# EAGLE design 858D_v2 (EAGLE 6.4)
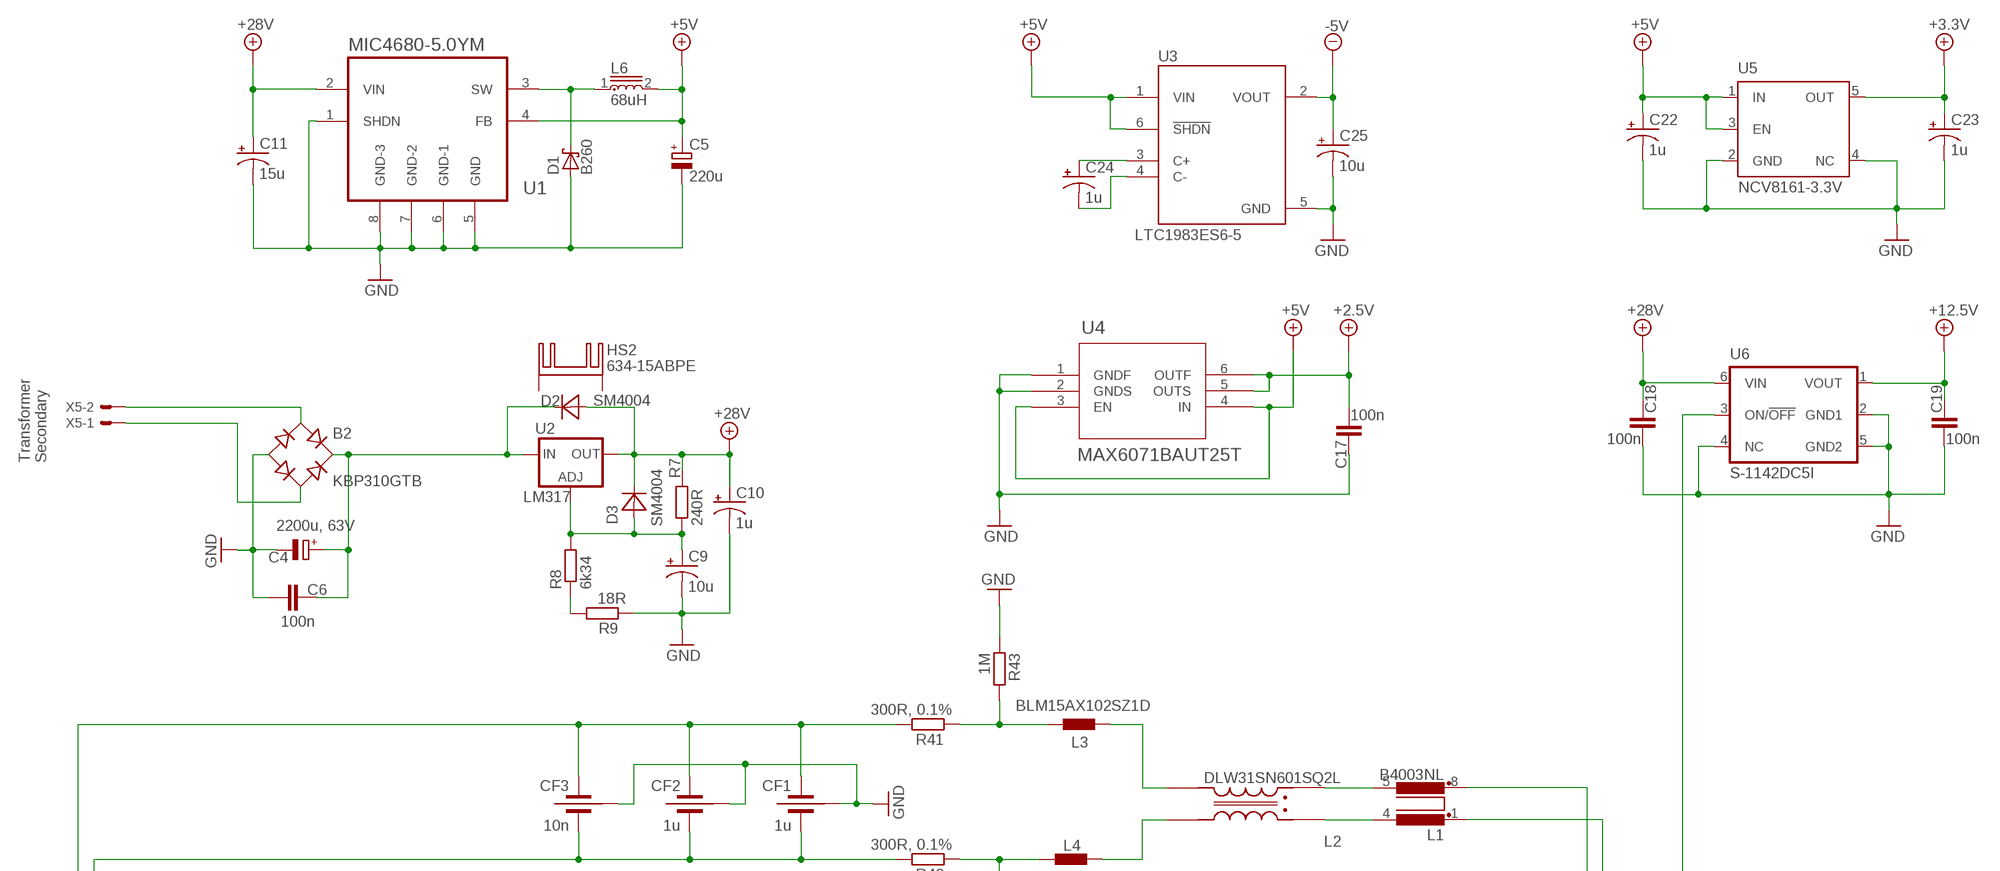
[diagram p0: schematic, sheet 1, part 1 of 2]
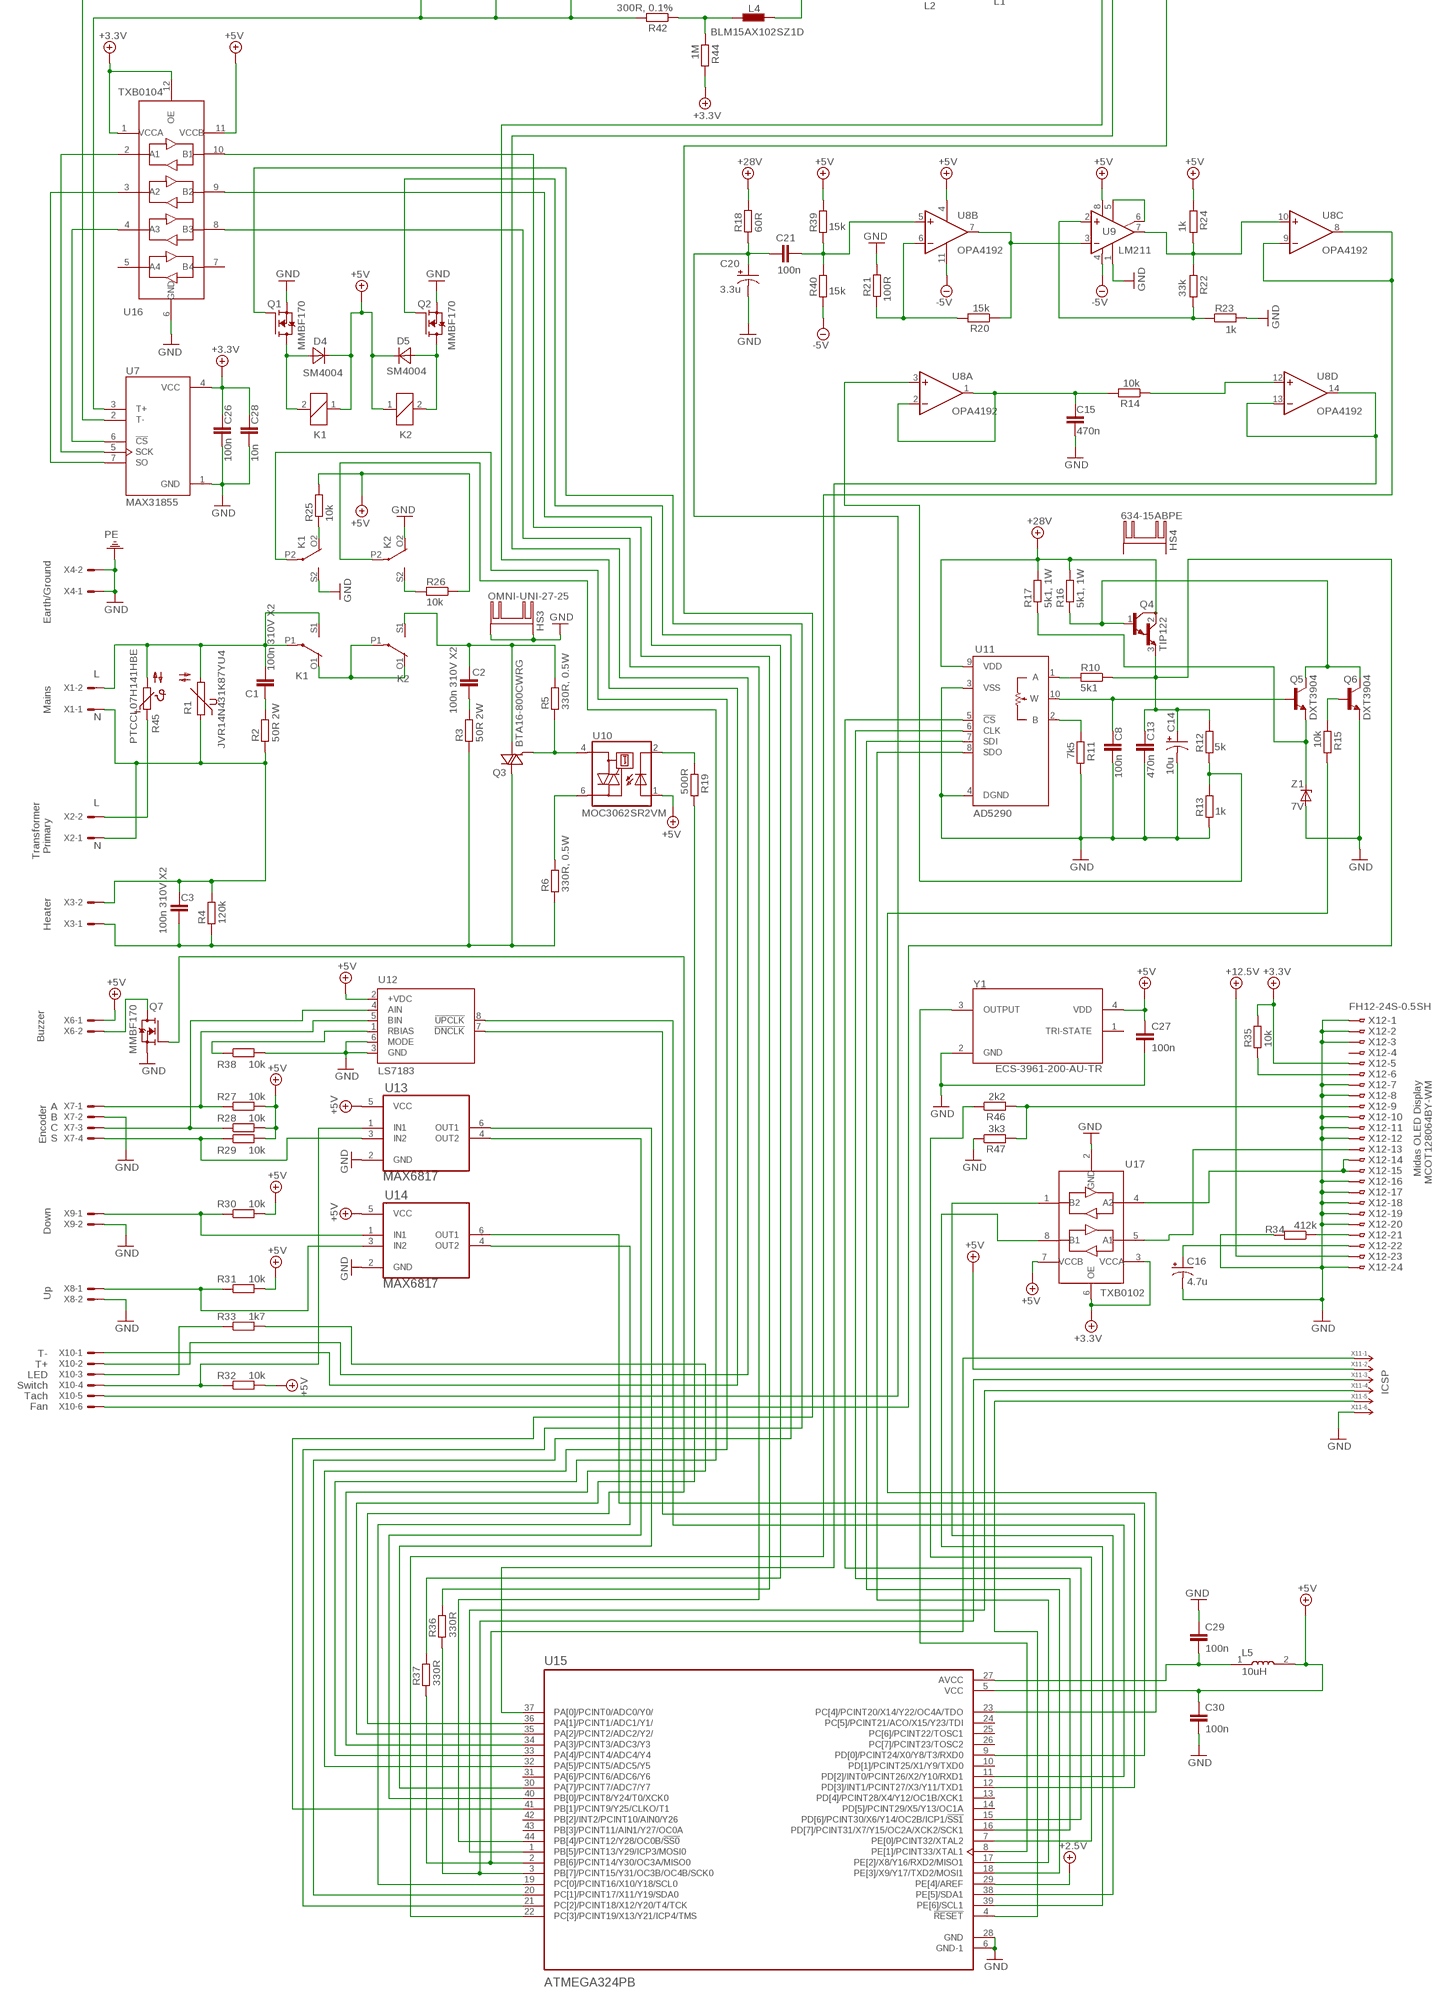
[diagram p1: schematic, sheet 1, part 2 of 2]

## Parts
B2  KBP310GTB  RECTIFIER-2KBP  [2KBP]
C1  100n 310V X2  C10/6  [C10B6]
C2  100n 310V X2  C10/6  [C10B6]
C3  100n 310V X2  C10/6  [C10B6]
C4  2200u, 63V  CPOL-EUE7.5-18  [E7,5-18]
C5  220u  CPOL-EUUD-8X10  [UD-8X10_NICHICON]
C6  100n  C-EUC1206  [C1206]
C8  100n  C-EUC1206  [C1206]
C9  10u  CPOL-USCT7343  [CT7343]
C10  1u  CPOL-USB/3528-21W  [B/3528-21W]
C11  15u  CPOL-USCT7343  [CT7343]
C13  470n  C-EUC1206  [C1206]
C14  10u  CPOL-USCT7343  [CT7343]
C15  470n  C-EUC1206  [C1206]
C16  4.7u  CPOL-USB/3528-21W  [B/3528-21W]
C17  100n  C-EUC1206  [C1206]
C18  100n  C-EUC1206  [C1206]
C19  100n  C-EUC1206  [C1206]
C20  3.3u  CPOL-USB/3528-21W  [B/3528-21W]
C21  100n  C-EUC1206  [C1206]
C22  1u  CPOL-USB/3528-21W  [B/3528-21W]
C23  1u  CPOL-USB/3528-21W  [B/3528-21W]
C24  1u  CPOL-USB/3528-21W  [B/3528-21W]
C25  10u  CPOL-USCT7343  [CT7343]
C26  100n  C-EUC1206  [C1206]
C27  100n  C-EUC1206  [C1206]
C28  10n  C-EUC0603  [C0603]
C29  100n  C-EUC1206  [C1206]
C30  100n  C-EUC1206  [C1206]
CF1  1u  X2Y1206  [C1206-X2Y]
CF2  1u  X2Y1206  [C1206-X2Y]
CF3  10n  X2Y06030603  [C0603-X2Y]
D1  B260  SCHOTTKY-DIODESMA  [SMA-DO214AC_2]
D2  SM4004  [SOD123FL]
D3  SM4004  [SOD123FL]
D4  SM4004  [SOD123FL]
D5  SM4004  [SOD123FL]
HS2  634-15ABPE  [634-15ABPE]
HS3  OMNI-UNI-27-25  [OMNI-UNI-27-25]
HS4  634-15ABPE  [634-15ABPE]
K1  4052  [F4052]
K2  4052  [F4052]
L1  B4003NL  [SMD-VERTICAL]
L2  DLW31SN601SQ2L  DLW31SN900SQ2L  [FIL_DLW31SN900SQ2L]
L3  BLM15AX102SZ1D  BLM15HB121SN1  [0402]
L4  BLM15AX102SZ1D  BLM15HB121SN1  [0402]
L5  10uH  KLZ1608MHR100WTD25  [INDC1608X95N]
L6  68uH  SRN8040A  [SRN8040]
Q1  MMBF170  MMBF170LT1G  [SOT23]
Q2  MMBF170  MMBF170LT1G  [SOT23]
Q3  BTA16-800CWRG  BT138-V  [TO220BV]
Q4  TIP122  TIP122-V  [TO220V]
Q5  DXT3904  [SOT89-BCE]
Q6  DXT3904  [SOT89-BCE]
Q7  MMBF170  MMBF170LT1G  [SOT23]
R1  JVR14N431K87YU4  S14K11  [S14K11]
R2  50R 2W  R-EU_0613/5V  [P0613V]
R3  50R 2W  R-EU_0613/5V  [P0613V]
R4  120k  R-EU_0207/10  [0207/10]
R5  330R, 0.5W  R-EU_R0805  [R0805]
R6  330R, 0.5W  R-EU_R0805  [R0805]
R7  240R  R-EU_R0603  [R0603]
R8  6k34  R-EU_R0603  [R0603]
R9  18R  R-EU_R0603  [R0603]
R10  5k1  R-EU_R0402  [R0402]
R11  7k5  R-EU_R0603  [R0603]
R12  5k  R-EU_R0402  [R0402]
R13  1k  R-EU_R0402  [R0402]
R14  10k  R-EU_R0402  [R0402]
R15  10k  R-EU_R0402  [R0402]
R16  5k1, 1W  R-EU_0411/3V  [0411V]
R17  5k1, 1W  R-EU_0411/3V  [0411V]
R18  60R  R-EU_R0805  [R0805]
R19  500R  R-EU_R0402  [R0402]
R20  15k  R-EU_R0402  [R0402]
R21  100R  R-EU_R0402  [R0402]
R22  33k  R-EU_R0402  [R0402]
R23  1k  R-EU_R0402  [R0402]
R24  1k  R-EU_R0402  [R0402]
R25  10k  R-EU_R0402  [R0402]
R26  10k  R-EU_R0402  [R0402]
R27  10k  R-EU_R0402  [R0402]
R28  10k  R-EU_R0402  [R0402]
R29  10k  R-EU_R0402  [R0402]
R30  10k  R-EU_R0402  [R0402]
R31  10k  R-EU_R0402  [R0402]
R32  10k  R-EU_R0402  [R0402]
R33  1k7  R-EU_R0603  [R0603]
R34  412k  R-EU_R0603  [R0603]
R35  10k  R-EU_R0402  [R0402]
R36  330R  R-EU_R0402  [R0402]
R37  330R  R-EU_R0402  [R0402]
R38  10k  R-EU_R0402  [R0402]
R39  15k  R-EU_R0402  [R0402]
R40  15k  R-EU_R0402  [R0402]
R41  300R, 0.1%  R-EU_R0603  [R0603]
R42  300R, 0.1%  R-EU_R0603  [R0603]
R43  1M  R-EU_R0402  [R0402]
R44  1M  R-EU_R0402  [R0402]
R45  PTCCL07H141HBE  B57164  [B57164]
R46  2k2  R-EU_R0402  [R0402]
R47  3k3  R-EU_R0402  [R0402]
U1  MIC4680-5.0YM  [SOIC127P600X175-8N]
U2  LM317  LM317TS  [317TS]
U3  LTC1983ES6-5  LTC1983ES6-5#TRPBF  [SOT95P280X100-6N]
U4  MAX6071BAUT25T  [21-0058I]
U5  NCV8161-3.3V  NCV8161ASN330T1G  [SOT23-DBV]
U6  S-1142DC5I  S-1142CC5I-E6T1U  [HSOP-6]
U7  MAX31855  [SOIC127P600X175-8N]
U8  OPA4192  OP11D  [SO14]
U9  LM211  LM311D  [SO08]
U10  MOC3062SR2VM  MOC3041S  [DIL6-SMD]
U11  AD5290  [MSOP10]
U12  LS7183  LS7183-SOIC  [SOIC08]
U13  MAX6817  MAX6817EUT+T  [SOT95P280X145-6N]
U14  MAX6817  MAX6817EUT+T  [SOT95P280X145-6N]
U15  ATMEGA324PB  ATMEGA324PB-ANR  [QFP80P1200X1200X120-44N]
U16  TXB0104  TXB0104UQFN  [QFN40P170X200X50-12N]
U17  TXB0102  TXB01028-VFSOP  [8-VFSOP]
X1  KK-156-2  [KK-156-2]
X2  KK-156-2  [KK-156-2]
X3  KK-156-2  [KK-156-2]
X4  KK-156-2  [KK-156-2]
X5  KK-156-2  [KK-156-2]
X6  22-23-2021  [22-23-2021]
X7  22-23-2041  [22-23-2041]
X8  22-23-2021  [22-23-2021]
X9  22-23-2021  [22-23-2021]
X10  22-23-2061  [22-23-2061]
X11  87758-06_S  [87758-06]
X12  FH12-24S-0.5SH  [FH12-24S-0.5SH]
Y1  ECS-3961-200-AU-TR  [OSC_ECS-3961-200-AU-TR]
Z1  7V  ZENER-DIODEDO-219AC  [MICROSMF]

## Nets
28AC1: B2.AC2 X5.1
28AC2: B2.AC1 X5.2
28DC: B2.+ C4.+ C6.2 D2.C U2.3(IN)
+2.5V: C17.2 U4.5(OUTS) U4.6(OUTF) U15.29(PE[4]/AREF)
+3.3V: C23.+ C26.1 C28.1 R35.1 R44.2 U5.5(OUT) U7.4(VCC) U16.1(VCCA) U16.12(OE) U17.3(VCCA) U17.6(OE) X12.5
+5V: C5.+ C22.+ C27.1 C30.1 D4.C D5.C K1.1 K2.1 L5.2 L6.2 R24.1 R25.2 R26.1 R27.2 R28.2 R29.2 R30.2 R31.2 R32.2 R39.1 U1.4(FB) U3.1(VIN) U3.6(!SHDN) U4.3(EN) U4.4(IN) U5.1(IN) U5.3(EN) U8.4(P:V+) U9.8(V+) U10.1(A) U12.2(+VDC) U13.5(VCC) U14.5(VCC) U15.5(VCC) U16.11(VCCB) U17.7(VCCB) X6.1 X11.2 Y1.4(VDD)
+12.5V: C19.1 U6.1(VOUT) X12.23
+28V: C10.+ C11.+ C18.1 D2.A D3.C Q4.2(C) R7.2 R16.2 R17.2 R18.2 U1.2(VIN) U2.2(OUT) U6.6(VIN) U11.9(VDD)
-5V: C25.+ R40.2 U3.2(VOUT) U8.11(P:V-) U9.4(V-)
FAN: C13.1 C14.+ Q4.3(E) R10.1 R12.1 X10.6
GND: B2.- C4.- C5.- C6.1 C8.2 C9.- C10.- C11.- C13.2 C14.- C15.2 C16.- C17.1 C18.2 C19.2 C20.- C22.- C23.- C25.- C26.2 C27.2 C28.2 C29.1 C30.2 CF1.3 CF2.3 CF3.3 D1.A HS3.A2,2(K) HS3.B2,2(K) K1.S2(3:S) K2.O2(3:O) Q1.2(S) Q2.2(S) Q6.E Q7.2(S) R9.1 R11.2 R13.2 R21.2 R23.2 R34.2 R38.2 R43.1 R47.1 U1.1(SHDN) U1.5(GND) U1.6(GND-1) U1.7(GND-2) U1.8(GND-3) U3.5(GND) U4.1(GNDF) U4.2(GNDS) U5.2(GND) U5.4(NC) U6.2(GND1) U6.4(NC) U6.5(GND2) U7.1(GND) U9.1(GND) U11.3(VSS) U11.4(DGND) U12.3(GND) U12.6(MODE) U13.2(GND) U14.2(GND) U15.6(GND-1) U15.28(GND) U16.6(GND) U17.2(GND) X4.1 X4.2 X7.2 X8.2 X9.2 X11.6 X12.1 X12.2 X12.3 X12.7 X12.8 X12.10 X12.11 X12.12 X12.16 X12.17 X12.18 X12.19 X12.20 X12.24 Y1.2(GND) Z1.A ; supply symbol labelled PE
HOUT: C3.1 Q3.T2(A2) R3.1 R4.1 R6.1 X3.1
L: C1.2 K1.P1(2:P) K1.S1(2:S) R1.2 R45.2 X1.2
N$1: Q4.1(B) Q5.C Q5.C@1(C) Q6.C Q6.C@1(C) R16.1
N$2: R45.1 X2.2
N$3: R14.1 U8.12(D:+IN)
N$4: C1.1 R2.2
N$5: C2.1 R3.2
N$6: R6.2 U10.6(A2)
N$7: U17.4(A2) X12.14 X12.15
N$8: Q3.G R5.1 U10.4(A1)
N$9: U7.7(SO) U16.3(A2)
N$10: U7.5(SCK) U16.2(A1)
N$11: U17.5(A1) X12.13
N$12: U7.6(!CS) U16.4(A3)
N$13: U15.44(PB[4]/PCINT12/Y28/OC0B/!SS0) U16.8(B3)
N$14: C8.1 Q5.B U11.10(W)
N$17: R11.1 U11.2(B)
N$18: D4.A K1.2 Q1.3(D)
N$19: C9.+ D3.A R7.1 R8.2 U2.1(ADJ)
N$20: R8.1 R9.2
N$21: D5.A K2.2 Q2.3(D)
N$22: R10.2 U11.1(A)
N$23: D1.K(C) L6.1 U1.3(SW)
N$24: Q5.E R17.1 Z1.C
N$25: L1.8 X10.1
N$26: Q6.B R15.1
N$27: L1.1 X10.2
N$29: R36.2 U16.10(B1)
N$30: R37.2 U16.9(B2)
N$31: U6.3(ON/!OFF) U15.41(PB[1]/PCINT9/Y25/CLKO/T1)
N$32: R34.1 X12.21
N$33: R12.2 R13.1 U8.3(A:+IN)
N$34: U9.5(ON) U9.6(ON/STR)
N$35: C15.1 R14.2 U8.1(A:OUT) U8.2(A:-IN)
N$36: U8.13(D:-IN) U8.14(D:OUT) U15.37(PA[0]/PCINT0/ADC0/Y0/)
N$37: R19.1 U10.2(C)
N$38: C20.+ C21.1 R18.1 X10.5
N$39: R19.2 U15.35(PA[2]/PCINT2/ADC2/Y2/)
N$40: C21.2 R39.2 R40.1 U8.5(B:+IN)
N$41: R20.1 U8.7(B:OUT) U9.3(-IN)
N$42: R22.1 R24.2 U8.10(C:+IN) U9.7(OUT)
N$43: R20.2 R21.1 U8.6(B:-IN)
N$44: R22.2 R23.1 U9.2(+IN)
N$45: U8.8(C:OUT) U8.9(C:-IN) U15.22(PC[3]/PCINT19/X13/Y21/ICP4/TMS)
N$46: U11.5(!CS) U15.15(PD[6]/PCINT30/X6/Y14/OC2B/ICP1/!SS1)
N$47: U11.6(CLK) U15.16(PD[7]/PCINT31/X7/Y15/OC2A/XCK2/SCK1)
N$48: U11.7(SDI) U15.18(PE[3]/X9/Y17/TXD2/MOSI1)
N$49: U11.8(SDO) U15.17(PE[2]/X8/Y16/RXD2/MISO1)
N$50: Q2.1(G) U15.20(PC[1]/PCINT17/X11/Y19/SDA0)
N$51: K1.O2(3:O) R25.1
N$52: Q1.1(G) U15.21(PC[2]/PCINT18/X12/Y20/T4/TCK)
N$53: R15.2 U15.23(PC[4]/PCINT20/X14/Y22/OC4A/TDO)
N$54: K2.S2(3:S) R26.2
N$55: K2.P2(3:P) U15.33(PA[4]/PCINT4/ADC4/Y4)
N$56: K1.P2(3:P) U15.32(PA[5]/PCINT5/ADC5/Y5)
N$57: Q7.3(D) X6.2
N$58: Q7.1(G) U15.36(PA[1]/PCINT1/ADC1/Y1/)
N$59: R29.1 U13.3(IN2) X7.4
N$60: R28.1 U12.4(AIN) X7.3
N$61: R31.1 U14.3(IN2) X8.1
N$62: R27.1 U12.5(BIN) X7.1
N$63: R30.1 U14.1(IN1) X9.1
N$64: C16.+ X12.22
N$65: C24.+ U3.3(C+)
N$66: R32.1 U13.1(IN1) X10.4
N$67: C24.- U3.4(C-)
N$68: R33.1 X10.3
N$69: R37.1 U15.2(PB[6]/PCINT14/Y30/OC3A/MISO0) X11.1
N$70: R35.2 X12.6
N$71: R33.2 U15.34(PA[3]/PCINT3/ADC3/Y3)
N$72: U12.8(!UPCLK) U15.11(PD[2]/INT0/PCINT26/X2/Y10/RXD1)
N$73: U12.7(!DNCLK) U15.12(PD[3]/INT1/PCINT27/X3/Y11/TXD1)
N$74: U13.6(OUT1) U15.30(PA[7]/PCINT7/ADC7/Y7)
N$75: U13.4(OUT2) U15.40(PB[0]/PCINT8/Y24/T0/XCK0)
N$76: U14.4(OUT2) U15.19(PC[0]/PCINT16/X10/Y18/SCL0)
N$77: U14.6(OUT1) U15.9(PD[0]/PCINT24/X0/Y8/T3/RXD0)
N$78: CF1.2 CF2.2 CF3.2 R42.2 U7.3(T+)
N$79: U15.8(PE[1]/PCINT33/XTAL1) Y1.3(OUTPUT)
N$81: CF1.1 CF2.1 CF3.1 R41.2 U7.2(T-)
N$84: R36.1 U15.3(PB[7]/PCINT15/Y31/OC3B/OC4B/SCK0) X11.3
N$85: U15.1(PB[5]/PCINT13/Y29/ICP3/MOSI0) X11.4
N$86: U15.4(!RESET) X11.5
N$87: R38.1 U12.1(RBIAS)
N$88: L1.5 L2.4
N$89: L1.4 L2.1
N$90: L2.3 L3.2
N$91: L2.2 L4.2
N$92: L3.1 R41.1 R43.2
N$93: L4.1 R42.1 R44.1
N$94: C29.2 L5.1 U15.27(AVCC)
N$99: C3.2 R1.1 R2.1 R4.2 X1.1 X2.1 X3.2
RESET-I2C: R46.1 U15.7(PE[0]/PCINT32/XTAL2)
RESET-I2C-3.3: R46.2 R47.2 X12.9
SCL-I2C: U15.39(PE[6]/SCL1) U17.8(B1)
SDA-I2C: U15.38(PE[5]/SDA1) U17.1(B2)
SL1: K1.O1(2:O) K2.O1(2:O) K2.P1(2:P)
SL2: C2.2 K2.S1(2:S) Q3.T1(A1) R5.2
Unconnected: HS2.A2,2(K) HS2.B2,2(K) HS4.A2,2(K) HS4.B2,2(K) U15.10(PD[1]/PCINT25/X1/Y9/TXD0) U15.13(PD[4]/PCINT28/X4/Y12/OC1B/XCK1) U15.14(PD[5]/PCINT29/X5/Y13/OC1A) U15.24(PC[5]/PCINT21/ACO/X15/Y23/TDI) U15.25(PC[6]/PCINT22/TOSC1) U15.26(PC[7]/PCINT23/TOSC2) U15.31(PA[6]/PCINT6/ADC6/Y6) U15.42(PB[2]/INT2/PCINT10/AIN0/Y26) U15.43(PB[3]/PCINT11/AIN1/Y27/OC0A) U16.5(A4) U16.7(B4) X12.4 Y1.1(TRI-STATE)

## Notes on the sheet
- Transformer
  Secondary
- Earth/Ground
- L
- Mains
- N
- L
- N
- Transformer
    Primary
- Heater
- Buzzer
- Midas OLED Display
   MCOT128064BY-WM
- A
- B
- C
- Encoder | S
- Down
- Up
- T-
- T+
- LED | ICSP
- Switch
- Tach
- Fan

## Library data of the parts
B2 = rectifier:RECTIFIER-: Rectifier
C1-C3 = capacitor-wima:C: CAPACITOR naming: grid - package width
C4 C5 = rcl:CPOL-EU: POLARIZED CAPACITOR, European symbol
C6 C8 C13 C15 C17-C19 C21 C26-C30 = rcl:C-EU: CAPACITOR, European symbol
C9-C11 C14 C16 C20 C22-C25 = rcl:CPOL-US: POLARIZED CAPACITOR, American symbol
CF1-CF3 = rcl:X2Y
D1 = diode:SCHOTTKY-DIODE: Schottky Diode
D2-D5 = diode:SM4004: 1.0 Ampere Silion Rectifier 400V SMD
HS2 HS4 = heatsink_modified:634-15ABPE: Wakefield-Vette 634-15-ABPE
HS3 = heatsink_modified:OMNI-UNI-27-25
K1 K2 = relay:4052: RELAY 2 x switch, Finder; OC_FARNELL: unknown; OC_NEWARK: unknown
L1 = inductor-nkl:B4003NL: Pulse Electronics Common mode choke for ADSL and VDSL 45db attenuation at 500kHz 1500 Vrms isolation
L2 = DLW31SN900SQ2L:DLW31SN900SQ2L: Common Mode Chokes Dual 90Ohm 100MHz 370mA 300mOhm DCR SMD Embossed T/R; DESCRIPTION: Common Mode Chokes Dual 90Ohm 100MHz 370mA 300mOhm DCR SMD Embossed T/R; DIGI-KEY_PART_NUMBER: 490-1067-1-ND; DIGI-KEY_PURCHASE_URL: https://www.digikey.com/product-detail/en/murata-electronics-north-america/DLW31SN900SQ2L/490-1067-1-ND/584513?utm_source=snapeda&utm_medium=aggregator&utm_campaign=symbol; MF: Murata Electronics; MP: DLW31SN900SQ2L; PACKAGE: Horizontal-4 Murata Electronics
L3 L4 = inductors:BLM15H: EMIFIL (R) Chip Ferrite Bead for GHz Noise Source: http://www.murata.com/ Ferrite Bead BLM15H.pdf
L5 = KLZ1608MHR100WTD25:KLZ1608MHR100WTD25: FIXED IND 10UH 250MA 1.365 OHM; AVAILABILITY: Unavailable; DESCRIPTION: Inductor Decoupling Circuit Shielded Multi-Layer 10uH 20% 2MHz Ferrite 250mA 1.365Ohm DCR 0603 Automotive T/R; MF: TDK; MP: KLZ1608MHR100WTD25; PACKAGE: 0603 TDK; PRICE: None
L6 = inductors:SRN8040A: Bourns Semi-shielded Power Inductor
Q1 Q2 Q7 = transistor-fet:MMBF170LT1G: Power MOSFET 500 mA, 60 V, 5 ohms, N−Channel SOT−23
Q3 = triac:BT138: TRIAC Source: http://www.semiconductors.philips.com BT138_SERIES_2.pdf
Q4 = transistor:TIP122-V
Q5 Q6 = transistor-npn:DXT3904: Diodes Incorporated 40V, 1W NPN SMALL SIGNAL TRANSISTOR IN SOT89
R1 = varistor:S14K11: VARISTOR
R2-R15 R18-R44 R46 R47 = resistor:R-EU_: RESISTOR, European symbol
R16 R17 = rcl:R-EU_: RESISTOR, European symbol
R45 = ptc-ntc:B57164: SIEMENS NTC; MPN: B57164K474K52; OC_FARNELL: 9753451; OC_NEWARK: 29M3118
U1 = MIC4680-5.0YM:MIC4680-5.0YM: None; AVAILABILITY: Unavailable; DESCRIPTION: MIC4680 Series 34 V 200 kHz 1.3 A SuperSwitcher Buck Regulator - SOIC-8; MF: Micrel; MP: MIC4680-5.0YM; PACKAGE: SOIC-8 Micrel; PRICE: None
U2 = v-reg:LM317TS: VOLTAGE REGULATOR
U3 = LTC1983ES6-5_TRPBF:LTC1983ES6-5#TRPBF: Charge Pump INV -5V/-2.3V to -5.5V 100mA 6-Pin TSOT-23 T/R; DESCRIPTION: Charge Pump INV -5V/-2.3V to -5.5V 100mA 6-Pin TSOT-23 T/R; DIGI-KEY_PART_NUMBER: LTC1983ES6-5#TRPBFCT-ND; DIGI-KEY_PURCHASE_URL: https://www.digikey.co.uk/product-detail/en/linear-technology-analog-devices/LTC1983ES6-5-TRPBF/LTC1983ES6-5-TRPBFCT-ND/7897923?utm_source=snapeda&utm_medium=aggregator&utm_campaign=symbol; MF: Linear Technology/Analog; MP: LTC1983ES6-5#TRPBF; PACKAGE: SOT-23-6 Analog Devices / Linear Technology
U4 = MAX6071BAUT25T:MAX6071BAUT25T; DESCRIPTION: V-Ref Precision 2.5V 10mA 6-Pin SOT-23 T/R; DIGI-KEY_PART_NUMBER: MAX6071BAUT25+TCT-ND; DIGI-KEY_PURCHASE_URL: https://www.digikey.co.uk/product-detail/en/maxim-integrated/MAX6071BAUT25-T/MAX6071BAUT25-TCT-ND/5051522?utm_source=snapeda&utm_medium=aggregator&utm_campaign=symbol; MF: Maxim Integrated; MP: MAX6071BAUT25+T; PACKAGE: SOT-23-6 Maxim Integrated
U5 = texas:NCV8161ASN330T1G: ON Semiconductor 3.3V, 450 mA, Ultra-Low Noise and High PSRR LDO Regulator for RF and Analog Circuits
U6 = v-reg:S-1142CC5I-E6T1U: HIGH-WITHSTAND VOLTAGE LOW CURRENT CONSUMPTION LOW DROPOUT CMOS VOLTAGE REGULATOR
U7 = MAX31855:MAX31855: Cold-Junction Compensated Thermocouple-to-Digital Converter; AVAILABILITY: Unavailable; MF: Maxim Integrated; MP: MAX31855; PACKAGE: SO-8 Maxim Integrated; PRICE: None
U8 = linear:OP11: Quad Low-Offset Low-Power OP AMP The OP-11 is pin compatible with the OP-400 , LM148, HA4741, RM4156, and LT1014 operational amplifiers source http://products.analog.com/products/info.asp?product=OP400
U9 = linear:LM311: COMPARATOR
U10 = optocoupler2:MOC30*: 6-Pin DIP Zero-Cross Optoisolators Triac Driver Output (250/400 Volt Peak) Source: http://www.fairchildsemi.com/ds/MO/MOC3043-M.pdf; MF: FAIRCHILD SEMICONDUCTOR; MPN: MOC3041S-M; OC_FARNELL: unknown; OC_NEWARK: 05C2885
U11 = analog-devices:AD5290: Compact +30 V / ±15 V 256-Position Digital Potentiometer
U12 = LS7183:LS7183: Encoder to Counter Interface Source: http://www.usdigital.com/products/ls7183-ls7184/ls7183 ls7184 Data Sheet.pdf; AVAILABILITY: Unavailable; DESCRIPTION: Semi-Linear-Cmos Power Source; MF: LSI; MP: LS7183; PACKAGE: None; PRICE: None
U13 U14 = MAX6817EUT_T:MAX6817EUT+T: ±15kV ESD-Protected CMOS Switch Debouncers; DESCRIPTION: Ic Debouncer Switch Dual Sot23-6 - Max6817eut+t; DIGI-KEY_PART_NUMBER: MAX6817EUT+TCT-ND; DIGI-KEY_PURCHASE_URL: https://www.digikey.co.uk/product-detail/en/maxim-integrated/MAX6817EUT-T/MAX6817EUT-TCT-ND/774156?utm_source=snapeda&utm_medium=aggregator&utm_campaign=symbol; MF: Maxim Integrated; MP: MAX6817EUT+T; PACKAGE: SOT-23-6 Maxim Integrated
U15 = ATMEGA324PB-ANR:ATMEGA324PB-ANR: None; AVAILABILITY: Unavailable; DESCRIPTION: 20mhz, Tqfp, Extended Temp, Green 5 v t&r; MF: Microchip; MP: ATMEGA324PB-ANR; PACKAGE: TQFP-44 Microchip; PRICE: None
U16 = Texas Instruments - TXB0104:TXB0104: Texas Instruments TXB0104 4-bit bidirectional level shifter 1.2-3.6V Port A 1.65-5.5V Port B
U17 = Texas Instruments - TXB0104:TXB0102: Texas Instruments Voltage Level Translator Bidirectional 1 Circuit 2 Channel 100Mbps US8
X1-X5 = con-molex:KK-156-2: KK 156 HEADER Source: http://www.molex.com/pdm_docs/sd/026604100_sd.pdf; OC_FARNELL: unknown; OC_NEWARK: unknown
X6 X8 X9 = con-molex:22-23-2021: .100" (2.54mm) Center Header - 2 Pin; MF: MOLEX; MPN: 22-23-2021; OC_FARNELL: 1462926; OC_NEWARK: 25C3832
X7 = con-molex:22-23-2041: .100" (2.54mm) Center Header - 4 Pin; MF: MOLEX; MPN: 22-23-2041; OC_FARNELL: 1462920; OC_NEWARK: 38C0355
X10 = con-molex:22-23-2061: .100" (2.54mm) Center Header - 6 Pin; MF: MOLEX; MPN: 22-23-2061; OC_FARNELL: 1462922; OC_NEWARK: 27C1933
X11 = con-molex-milli-grid:87758-06_S: HEADER
X12 = con-hirose:FH12-24S-0.5S: 0.5mm Pitch Connectors For FPC/FFC Source: Data sheet <http://www.hirose.co.jp/cataloge_hp/e58605370.pdf>; MPN: FH12-24S-0.5SH(55); OC_FARNELL: 1324552; OC_NEWARK: 34M6170
Y1 = ECS-3961-200-AU-TR:ECS-3961-200-AU-TR: miniature SMD crystal controlled oscillators; DESCRIPTION: Clock Oscillator 20MHz 5V 30pF 4-Pin SMD T/R; DIGI-KEY_PART_NUMBER: XC1900CT-ND; DIGI-KEY_PURCHASE_URL: https://www.digikey.co.uk/product-detail/en/ecs-inc/ECS-3961-200-AU-TR/XC1900CT-ND/2782025?utm_source=snapeda&utm_medium=aggregator&utm_campaign=symbol; MF: ECS Inc.; MP: ECS-3961-200-AU-TR; PACKAGE: SMD-4 ECS International
Z1 = diode:ZENER-DIODE: Z-Diode

## Board
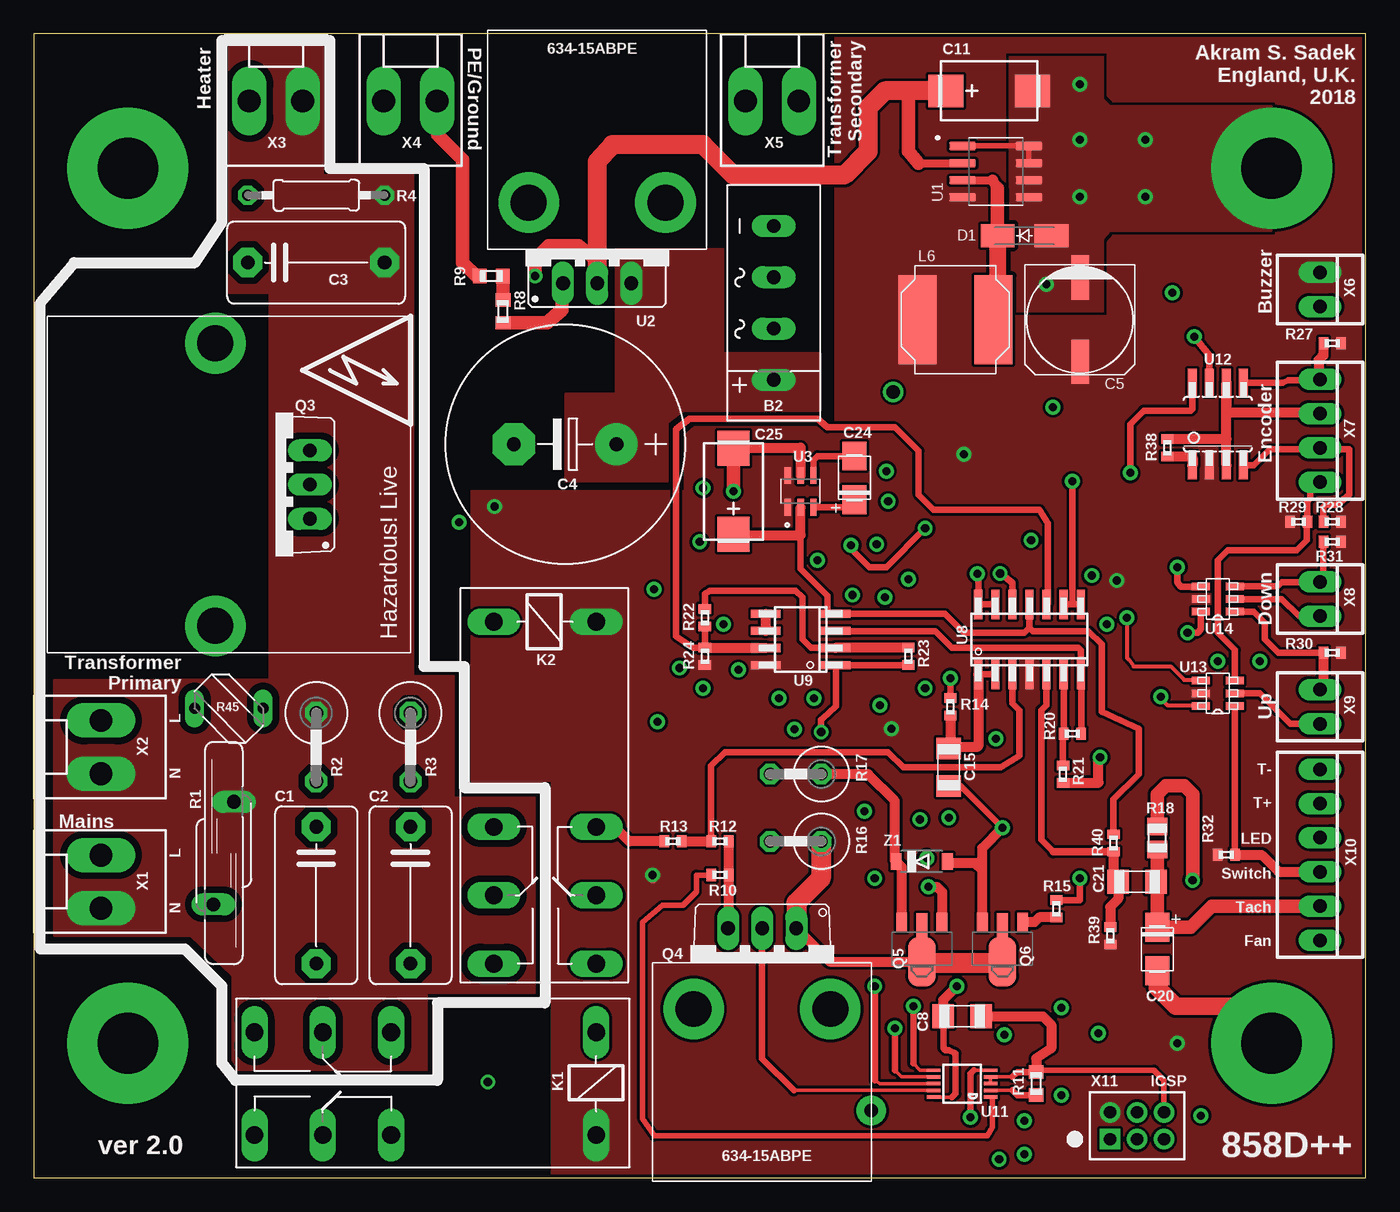
[diagram p2: board, top side]
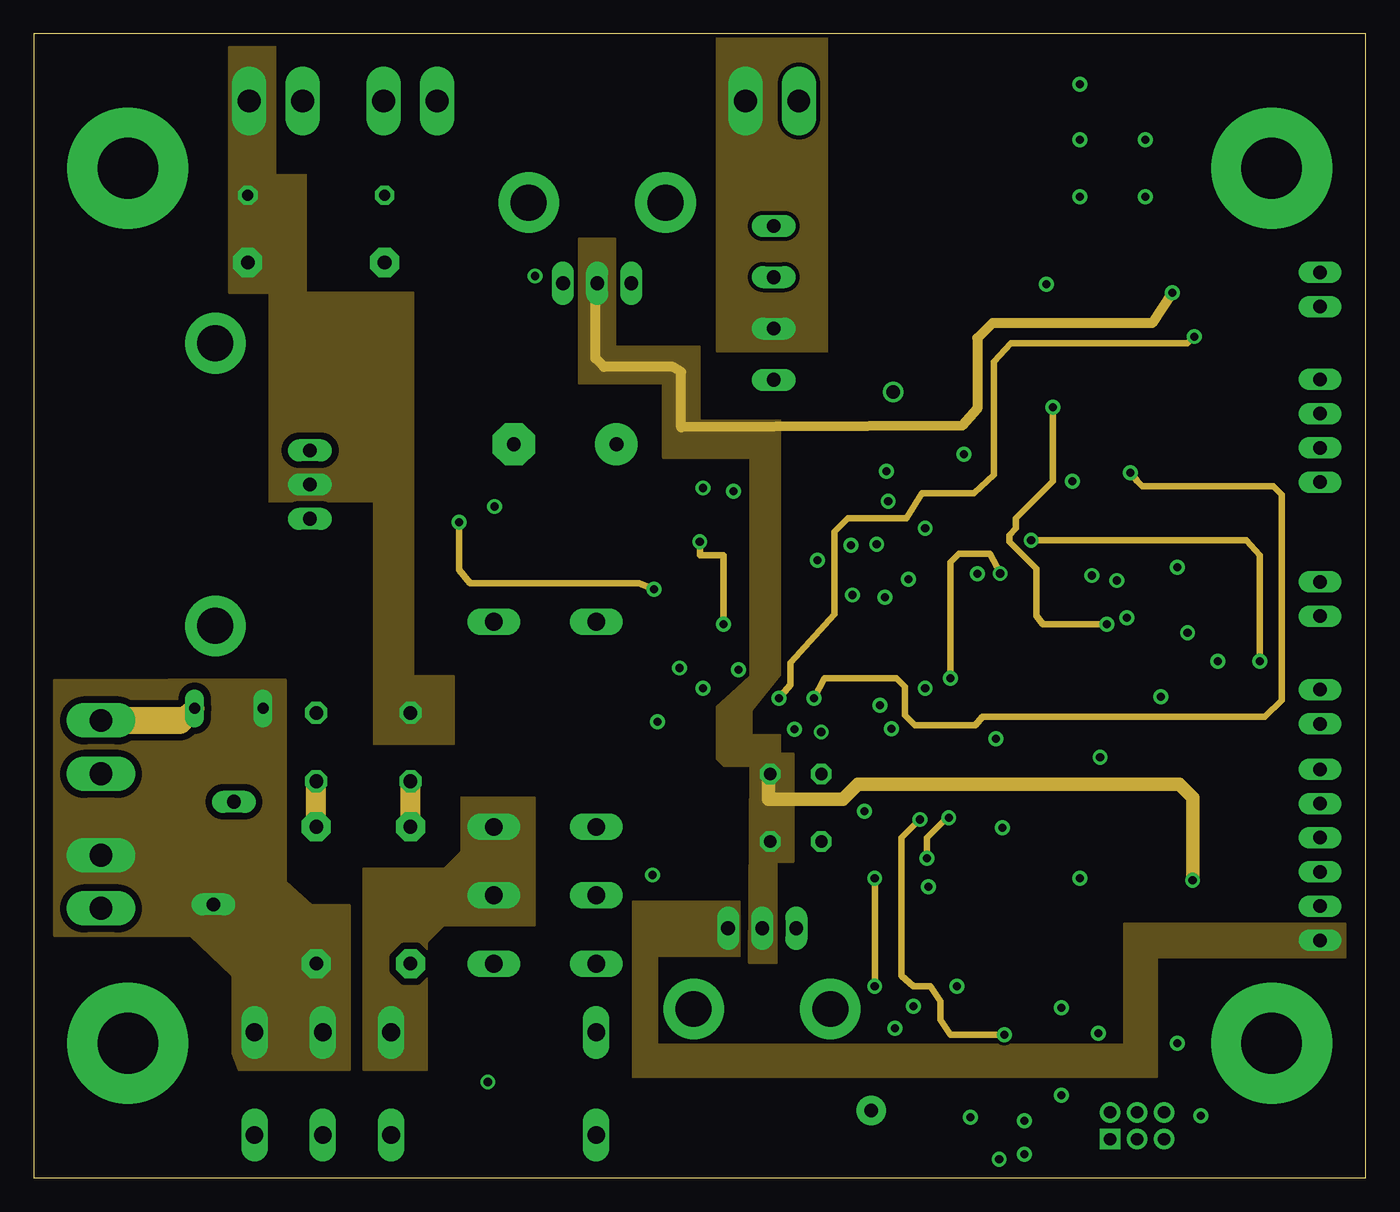
[diagram p3: board, inner layer Layer2]
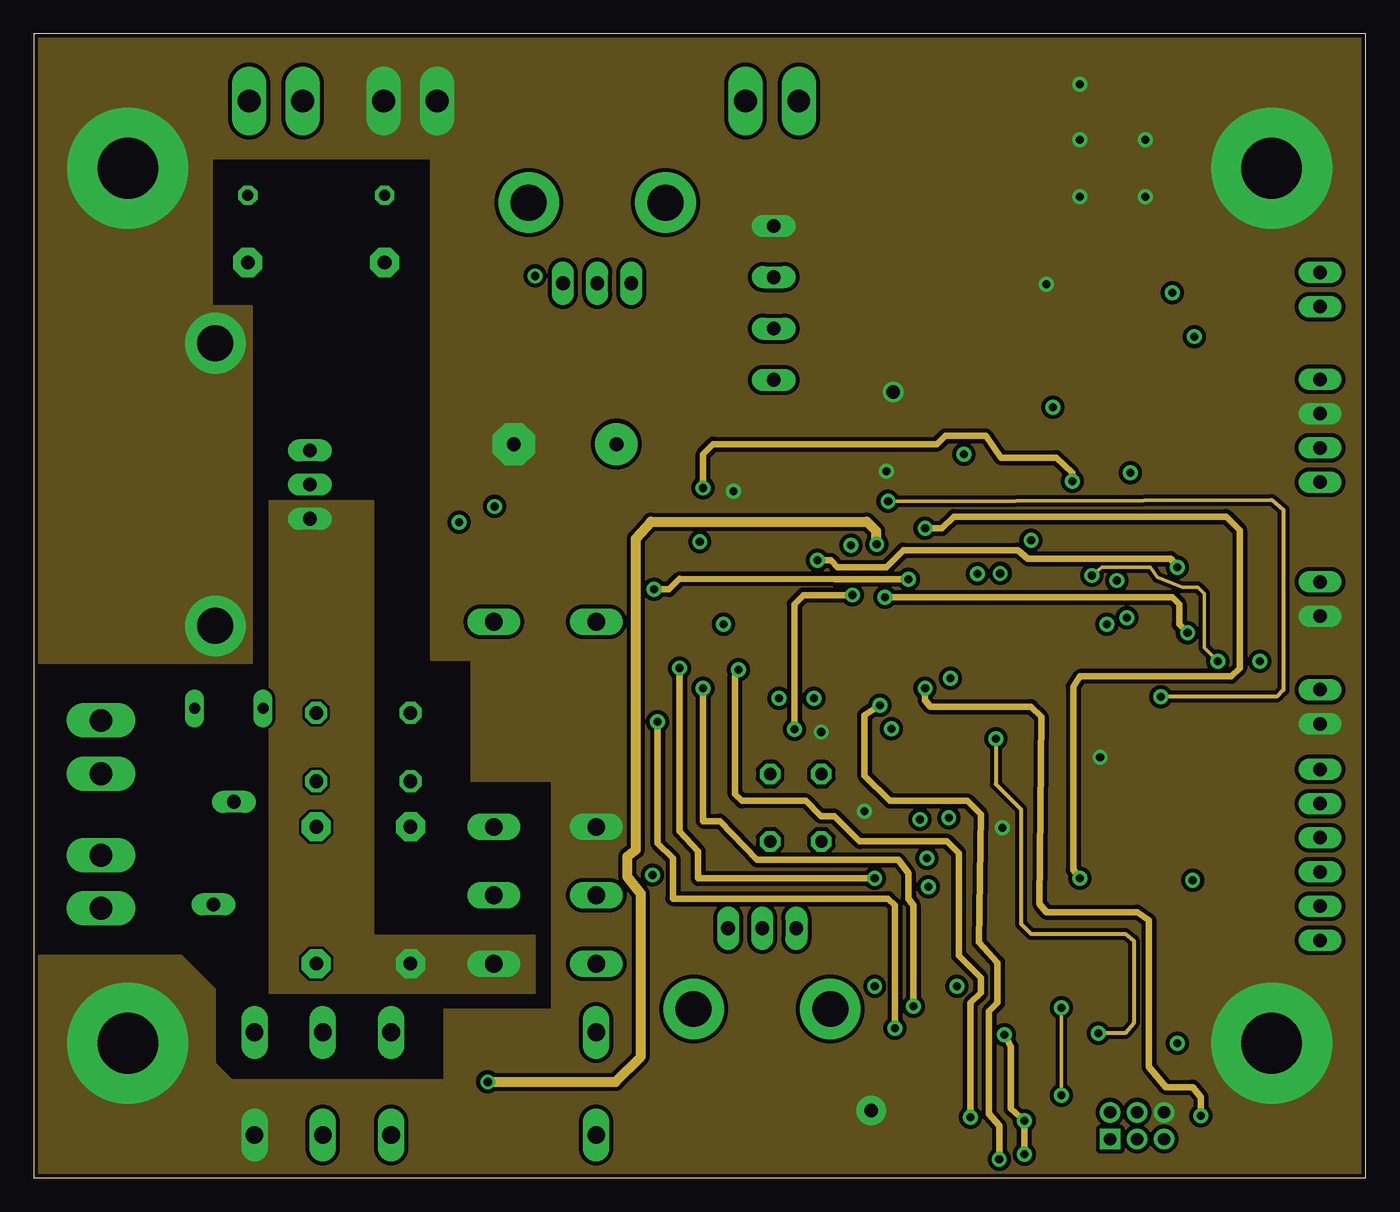
[diagram p4: board, inner layer Layer3]
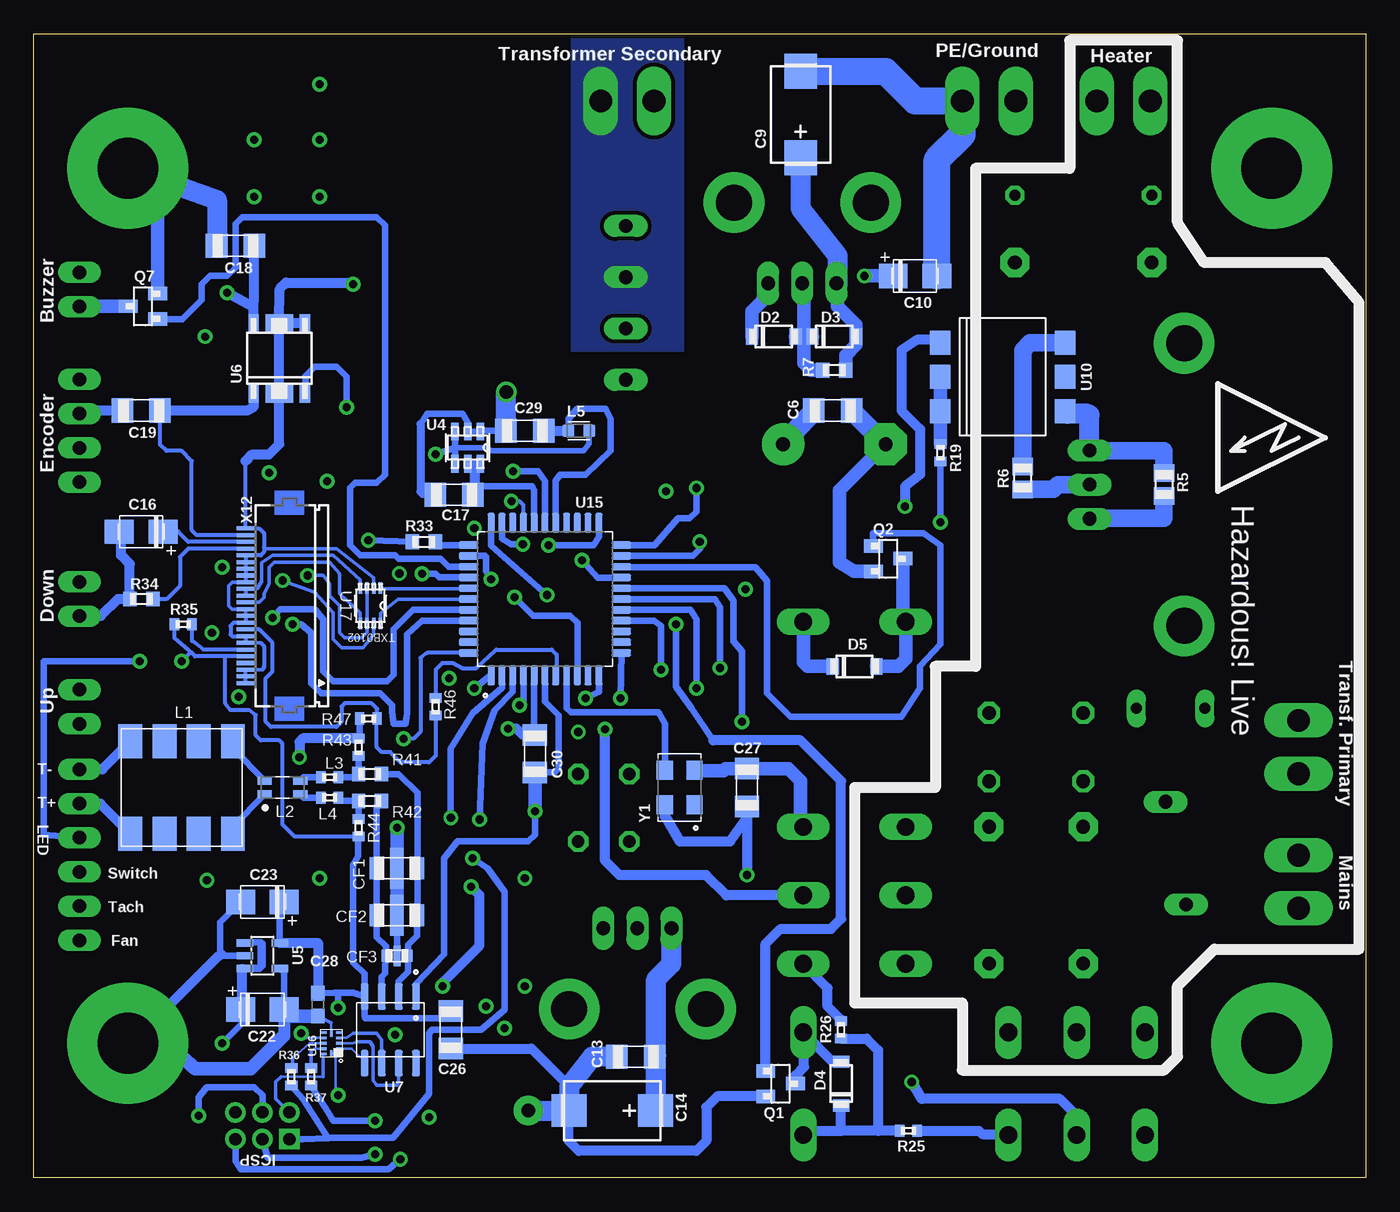
[diagram p5: board, bottom side, seen from below]

Size 99 x 85 mm. Coordinates in mm from the lower left corner, seen from the top.
Outline: 0,0 99,0 99,85 0,85 0,0
Copper layers (1+2*15+16): Top 0.035mm / dielectric 0.2mm / Layer2 0.035mm / dielectric 1.5mm / Layer3 0.035mm / dielectric 0.2mm / Bottom 0.035mm
Design rules "Sadek_SparkFun_4layer *": minimum track width 10mil, minimum drill 20mil, track to track 8mil, track to pad 8mil, pad to pad 8mil, via to via 8mil, smd to smd 8mil, copper to edge 10mil, drill to drill 8mil, minimum pad ring 12mil, minimum via ring 10mil, stop-mask expansion 4mil, vias tented up to drill 25mil, thermal gap 0mil
vRestrict: area 1.5,8 to 37.2,84

### Footprints (pad centres in the part's own frame; a part is rotated, then mirrored left to right if it is on the bottom)
2KBP = drill 1.016 long: + 5.715,0; - -5.715,0; AC1 -1.905,0; AC2 1.905,0
C10B6 = drill 1.016 pad 2.159 octagon: 1 -5.08,0; 2 5.08,0
E7,5-18 = drill 1.016 pad 3.15: + -3.81,0 | drill 1.016 pad 3.15 octagon: - 3.81,0
UD-8X10_NICHICON = smd 3.3 x 1.3: + 3.125,0; - -3.125,0
C1206 = smd 1.6 x 1.8: 1 -1.4,0; 2 1.4,0
CT7343 = smd 2.6 x 2.4: + -3.2,0; - 3.2,0
B/3528-21W = smd 2.15 x 1.8: + 1.625,0; - -1.625,0
C0603 = smd 1.1 x 1: 1 -0.85,0; 2 0.85,0
C1206-X2Y = smd 1.016 x 1.651: 1 -1.524,0; 2 1.524,0 | smd 1.016 x 3.048: 3 0,0
C0603-X2Y = smd 0.635 x 0.889: 1 -0.826,0; 2 0.826,0 | smd 0.508 x 1.524: 3 0,0
SMA-DO214AC_2 = smd 2.5 x 1.7: A -2,0; K 2,0
SOD123FL = smd 0.91 x 1.22: A 1.625,0; C -1.625,0
634-15ABPE = drill 2.67 pad 4.5: A2,2 -5.207,3.454; B2,2 4.953,3.454
OMNI-UNI-27-25 = drill 2.67 pad 4.5: A2,2 -10,-4.5; B2,2 11,-4.5
F4052 = drill 1.321 long: 1 -3.81,3.81; 2 -3.81,-3.81; O1 11.43,-3.81; O2 11.43,3.81; P1 16.51,-3.81; P2 16.51,3.81; S1 21.59,-3.81; S2 21.59,3.81
SMD-VERTICAL = smd 1.778 x 2.54: 1 3.81,3.429; 2 1.27,3.429; 3 -1.27,3.429; 4 -3.81,3.429; 5 -3.81,-3.429; 6 -1.27,-3.429; 7 1.27,-3.429; 8 3.81,-3.429
FIL_DLW31SN900SQ2L = smd 0.6 x 1.05: 1 -0.5,1.325; 2 -0.5,-1.325; 3 0.5,-1.325; 4 0.5,1.325
0402 = smd 0.7 x 0.9: 1 -0.65,0; 2 0.65,0
INDC1608X95N = smd 0.9 x 0.97: 1 -0.785,0; 2 0.785,0
SRN8040 = smd 2.85 x 6.6: 1 -2.825,0; 2 2.825,0
SOT23 = smd 1 x 1.4: 1 -0.95,-1.1; 2 0.95,-1.1; 3 0,1.1
TO220BV = drill 1.016 long: G 2.54,-2.54; T1 -2.54,-2.54; T2 0,-2.54
TO220V = drill 1.016 long: 1 -2.54,-2.54; 2 0,-2.54; 3 2.54,-2.54
SOT89-BCE = smd 0.8 x 1.4: B -1.499,-1.981; E 1.499,-1.981 | smd 0.8 x 1.9: C 0,-1.727 | smd 2.032 x 3.65: C@1 0,0.94
S14K11 = drill 1.016 long: 1 -0.762,-3.81; 2 0.762,3.81
P0613V = drill 1.016 octagon: 1 -2.54,0; 2 2.54,0
0207/10 = drill 0.813 octagon: 1 -5.08,0; 2 5.08,0
R0805 = smd 1.3 x 1.5: 1 -0.85,0; 2 0.85,0
R0603 = smd 1 x 1.1: 1 -0.85,0; 2 0.85,0
R0402 = smd 0.7 x 0.9: 1 -0.65,0; 2 0.65,0
0411V = drill 0.914 octagon: 1 -2.54,0; 2 1.27,0
B57164 = drill 0.813 long: 1 -2.54,0; 2 2.54,0
SOIC127P600X175-8N = smd 1.97 x 0.6: 1 -2.475,1.905; 2 -2.475,0.635; 3 -2.475,-0.635; 4 -2.475,-1.905; 5 2.475,-1.905; 6 2.475,-0.635; 7 2.475,0.635; 8 2.475,1.905
317TS = drill 1.016 long: 1 -2.54,-2.54; 2 0,-2.54; 3 2.54,-2.54
SOT95P280X100-6N = smd 1.24 x 0.55: 1 -1.185,0.95; 2 -1.185,0; 3 -1.185,-0.95; 4 1.185,-0.95; 5 1.185,0; 6 1.185,0.95
21-0058I = smd 1.321 x 0.559: 1 -1.194,0.94; 2 -1.194,0; 3 -1.194,-0.94; 4 1.194,-0.94; 5 1.194,0; 6 1.194,0.94
SOT23-DBV = smd 0.55 x 1.2: 1 -0.95,-1.3; 2 0,-1.3; 3 0.95,-1.3; 4 0.95,1.3; 5 -0.95,1.3
HSOP-6 = smd 0.76 x 1.27: 1 -1.905,-2.64; 3 1.915,-2.64; 4 1.915,2.64; 6 -1.905,2.64 | smd 2.03 x 1.27: 2 0.005,-2.64 | smd 2.06 x 1.27: 5 0.005,2.64
SOIC127P600X175-8N' = smd 1.97 x 0.59: 1 -2.475,1.905; 2 -2.475,0.635; 3 -2.475,-0.635; 4 -2.475,-1.905; 5 2.475,-1.905; 6 2.475,-0.635; 7 2.475,0.635; 8 2.475,1.905
SO14 = smd 0.6 x 2.2: 1 -3.81,-2.6; 2 -2.54,-2.6; 3 -1.27,-2.6; 4 0,-2.6; 5 1.27,-2.6; 6 2.54,-2.6; 7 3.81,-2.6; 8 3.81,2.6; 9 2.54,2.6; 10 1.27,2.6; 11 0,2.6; 12 -1.27,2.6; 13 -2.54,2.6; 14 -3.81,2.6
SO08 = smd 0.6 x 2.2: 1 -1.905,-2.6; 2 -0.635,-2.6; 3 0.635,-2.6; 4 1.905,-2.6; 5 1.905,2.6; 6 0.635,2.6; 7 -0.635,2.6; 8 -1.905,2.6
DIL6-SMD = smd 1.78 x 1.52: 1 -2.54,-4.645; 2 0,-4.645; 3 2.54,-4.645; 4 2.54,4.645; 5 0,4.645; 6 -2.54,4.645
MSOP10 = smd 0.25 x 1: 1 -1,-2.113; 2 -0.5,-2.113; 3 0,-2.113; 4 0.5,-2.113; 5 1,-2.113; 6 1,2.113; 7 0.5,2.113; 8 0,2.113; 9 -0.5,2.113; 10 -1,2.113
SOIC08 = smd 0.66 x 2.032: 1 -1.905,-3.073; 2 -0.635,-3.073; 3 0.635,-3.073; 4 1.905,-3.073; 5 1.905,3.073; 6 0.635,3.073; 7 -0.635,3.073; 8 -1.905,3.073
SOT95P280X145-6N = smd 1.321 x 0.559: 1 -1.27,0.94; 2 -1.27,0; 3 -1.27,-0.94; 4 1.27,-0.94; 5 1.27,0; 6 1.27,0.94
QFP80P1200X1200X120-44N = smd 1.47 x 0.55: 1 -5.67,4; 2 -5.67,3.2; 3 -5.67,2.4; 4 -5.67,1.6; 5 -5.67,0.8; 6 -5.67,0; 7 -5.67,-0.8; 8 -5.67,-1.6; 9 -5.67,-2.4; 10 -5.67,-3.2; 11 -5.67,-4; 23 5.67,-4; 24 5.67,-3.2; 25 5.67,-2.4; 26 5.67,-1.6; 27 5.67,-0.8; 28 5.67,0; 29 5.67,0.8; 30 5.67,1.6; 31 5.67,2.4; 32 5.67,3.2; 33 5.67,4 | smd 0.55 x 1.47: 12 -4,-5.67; 13 -3.2,-5.67; 14 -2.4,-5.67; 15 -1.6,-5.67; 16 -0.8,-5.67; 17 0,-5.67; 18 0.8,-5.67; 19 1.6,-5.67; 20 2.4,-5.67; 21 3.2,-5.67; 22 4,-5.67; 34 4,5.67; 35 3.2,5.67; 36 2.4,5.67; 37 1.6,5.67; 38 0.8,5.67; 39 0,5.67; 40 -0.8,5.67; 41 -1.6,5.67; 42 -2.4,5.67; 43 -3.2,5.67; 44 -4,5.67
QFN40P170X200X50-12N = smd 0.5 x 0.2: 1 -0.6,0.8; 2 -0.6,0.4; 3 -0.6,0; 4 -0.6,-0.4; 5 -0.6,-0.8; 7 0.6,-0.8; 8 0.6,-0.4; 9 0.6,0; 10 0.6,0.4; 11 0.6,0.8 | smd 0.2 x 0.5: 6 0,-0.75; 12 0,0.75
8-VFSOP = smd 0.864 x 0.254: 1 -1.321,0.75; 2 -1.321,0.25; 3 -1.321,-0.25; 4 -1.321,-0.75; 5 1.321,-0.75; 6 1.321,-0.25; 7 1.321,0.25; 8 1.321,0.75
KK-156-2 = drill 1.7 pad 2.184 long: 1 -1.98,0; 2 1.98,0
22-23-2021 = drill 1 long: 1 -1.27,0; 2 1.27,0
22-23-2041 = drill 1 long: 1 -3.81,0; 2 -1.27,0; 3 1.27,0; 4 3.81,0
22-23-2061 = drill 1 long: 1 -6.35,0; 2 -3.81,0; 3 -1.27,0; 4 1.27,0; 5 3.81,0; 6 6.35,0
87758-06 = drill 0.914 square: 1 -2,-1 | drill 0.914: 2 -2,1; 3 0,-1; 4 0,1; 5 2,-1; 6 2,1
FH12-24S-0.5SH = smd 0.3 x 1.3: 1 -5.75,3.25; 2 -5.25,3.25; 3 -4.75,3.25; 4 -4.25,3.25; 5 -3.75,3.25; 6 -3.25,3.25; 7 -2.75,3.25; 8 -2.25,3.25; 9 -1.75,3.25; 10 -1.25,3.25; 11 -0.75,3.25; 12 -0.25,3.25; 13 0.25,3.25; 14 0.75,3.25; 15 1.25,3.25; 16 1.75,3.25; 17 2.25,3.25; 18 2.75,3.25; 19 3.25,3.25; 20 3.75,3.25; 21 4.25,3.25; 22 4.75,3.25; 23 5.25,3.25; 24 5.75,3.25
OSC_ECS-3961-200-AU-TR = smd 1.4 x 1.2: 1 -1.27,-1.1; 2 1.27,-1.1; 3 1.27,1.1; 4 -1.27,1.1
MICROSMF = smd 0.8 x 1.2: A 1.9,0; C -1.9,0

### Placement (x,y rotation side)
B2  55,65 270 top
C1  21,21 270 top
C2  28,21 270 top
C3  21,68 0 top
C4  39.5,54.5 180 top
C5  77.75,63.75 270 top
C6  39.62,57 180 bottom
C8  69,12 0 top
C9  42,79 90 bottom
C10  33.5,67 180 bottom
C11  71,80.75 0 top
C13  54.25,9 180 bottom
C14  56,5 180 bottom
C15  68,30.5 270 top
C16  91,48 0 bottom
C17  67.75,50.75 0 bottom
C18  84,69.25 180 bottom
C19  91,57 180 bottom
C20  83.5,17 90 top
C21  82,22 180 top
C22  82,12.5 180 bottom
C23  82,20.5 0 bottom
C24  61,52 270 top
C25  52,51 90 top
C26  68,11 270 bottom
C27  46,29 90 bottom
C28  77.88,12.88 270 bottom
C29  62.5,55.5 0 bottom
C30  61.75,31.5 270 bottom
CF1  72,23 180 bottom
CF2  72,19.5 180 bottom
CF3  72,16.5 180 bottom
D1  73.62,70 180 top
D2  44,62.5 0 bottom
D3  39.5,62.5 0 bottom
D4  39,7 90 bottom
D5  38,38 0 bottom
HS2  42,69 0 top
HS3  18,52 270 top
HS4  54,16 180 top
K1  38,7 180 top
K2  38,37.5 270 top
L1  88,29 180 bottom
L2  80.5,29 90 bottom
L3  77,29.75 180 bottom
L4  77,28.25 180 bottom
L5  58.5,55.5 0 bottom
L6  68.5,63.75 180 top
Q1  43.5,7 270 bottom
Q2  35.5,46 270 bottom
Q3  18,51.5 90 top
Q4  54.14,16 180 top
Q5  66,17 180 top
Q6  72,17 180 top
Q7  90.88,64.75 90 bottom
R1  14.12,24.12 180 top
R2  21,32 270 top
R3  28,32 270 top
R4  21,73 0 top
R5  15,51.5 270 bottom
R6  25.5,52 90 bottom
R7  39.5,60 180 bottom
R8  34.88,64.38 270 top
R9  34,67 0 top
R10  51,22.5 180 top
R11  74.5,7 90 top
R12  51,25 180 top
R13  47.5,25 180 top
R14  68.12,35 270 top
R15  76,20 90 top
R16  56,25 180 top
R17  56,30 180 top
R18  83.5,25.25 90 top
R19  31.62,53.88 270 bottom
R20  77.2,33 180 top
R21  76.5,30 270 top
R22  49.88,41.62 90 top
R23  65,38.75 270 top
R24  49.88,38.75 90 top
R25  34,3.5 180 bottom
R26  39,11 90 bottom
R27  96.5,62 0 top
R28  96.5,48.75 0 top
R29  94,48.75 180 top
R30  96.5,39 0 top
R31  96.5,47.25 0 top
R32  88.62,24 180 top
R33  70,47.25 0 bottom
R34  91,43 180 bottom
R35  87.88,41.12 0 bottom
R36  78.38,7.5 90 bottom
R37  79.85,7.5 90 bottom
R38  84.25,54.25 90 top
R39  80,18 90 top
R40  80.25,24.88 90 top
R41  74,30 0 bottom
R42  74,28 0 bottom
R43  74.85,32 270 bottom
R44  74.85,26 270 bottom
R45  14.5,34.88 0 top
R46  69.12,35 270 bottom
R47  74.12,34.12 0 bottom
U1  71.5,74.75 0 top
U2  41.88,69 0 top
U3  57,51 90 top
U4  66.75,54.25 270 bottom
U5  82,16.5 270 bottom
U6  80.75,60.88 0 bottom
U7  MAX31855  [SOIC127P600X175-8N']  72.5,11 270 bottom
U8  74,40 0 top
U9  57,40 90 top
U10  27,59.5 270 bottom
U11  69,7 90 top
U12  88,56 0 top
U13  88,36 180 top
U14  88,43 180 top
U15  61,43 90 bottom
U16  76.88,10 180 bottom
U17  73.97,42.5 270 bottom
X1  5,22 90 top
X2  5,32 90 top
X3  18,80 0 top
X4  28,80 0 top
X5  54.88,80 0 top
X6  95.6,66 270 top
X7  95.6,55.5 270 top
X8  95.6,43 270 top
X9  95.6,35 270 top
X10  95.6,24 270 top
X11  82,3.88 0 top
X12  80,42.5 90 bottom
Y1  51,29 90 bottom
Z1  66,23.5 0 top

### Tracks (layer width: path | path; a pad name or v marks a point on that pad's centre or on a via)
28AC1
  pour Layer2 (isolate 0.3, no thermals): 50.75,61.39 59,61.39 59,84.75 50.75,84.75
28AC2
  pour Bottom (isolate 0.3, no thermals): 50.75,61.39 59,61.39 59,84.75 50.75,84.75
28DC
  Bottom 1: D2.C 45.62,64.38 44.75,65.25 44.75,66.12 U2.3
  Bottom 1.5: C6.2 42.12,55.81 C4.+
  pour Top (no thermals): 39.5,51.77 47.12,51.77 47.12,56.12 48.25,57 58.5,57 58.5,61.25 51.25,61.25 51.25,69 43.25,69 43.25,58.25 39.5,58.25
+2.5V
  Bottom 0.5: U4.6 66.32,53.06 | U4.5 66.32,53.06 | 66.32,53.06 66.25,52.62 | 66.25,51.38 61.98,51.38 61.81,51.09 U15.29
  Bottom 0.75: 66.25,52.62 66.25,51.38 66.25,50.85 C17.2
+3.3V  (via drill 0.6)
  Layer3 0.25: v88,38.38 87,39.38 87,43.38 86.5,43.88 85.38,43.88 83.5,44.62 83,45.38 79.38,45.38 v78.62,44.75 | v76.38,6.12 v76.38,12.62
  Bottom 0.2: U16.12 76.58,9.2 | 76.58,9.2 U16.1 | 76.58,9.2 76.58,6.33
  Bottom 0.25: U17.3 U17.6 74.22,40.52 74.62,40.12 75.88,40.12 76.25,40.5 76.25,42.5 77,43.25 77,44.12 77.5,44.75 v78.62,44.75 | 76.58,6.33 v76.38,6.12 | 76.38,13.48 76.63,13.74
  Bottom 0.3: X12.5 84.75,38.75 | 84.75,38.75 87,38.75 87.25,39 | 87.25,39 88.53,40.1 R35.1 | R44.2 79.6,25.35 80.5,26.25 80.5,32.25 80.75,32.5 82.12,32.5 82.5,32.88 82.5,34.38 83,34.75 84.38,34.75 84.75,35.25 84.75,38.75 | 87.25,39 87.38,39 v88,38.38
  Bottom 0.5: U7.4 74.43,13.5 75.25,13.75 76.63,13.74 C28.1 | C23.+ 80.7,20.18 U5.5 | U7.4 74.41,15.15 75.25,16 75.25,23.25 74.88,23.88 74.88,25.32 R44.2 | U7.4 74.41,12.03 74.38,11.88 68.38,11.88 68.38,12.03 C26.1 | v76.38,12.62 76.38,13.48
  Bottom 0.75: U5.5 77.88,17.45 C28.1
+5V  (via drill 0.6)
  Top 0.75: v46,22.5 46,22.25
  Bottom 0.2: U16.11 77.47,8.97 | 77.5,7.5 80.62,7.5
  Bottom 0.25: U17.7 73.72,40.38 74.53,39.38 76.12,39.38 76.75,40 76.75,42 78.12,43.5 v80.5,44.38 | 77.47,8.97 77.5,8.75 77.5,7.5 | 80.62,7.5 81,7.12 81,5.88 X11.2
  Bottom 0.254: 39,5.25 D4.C | 83.5,15.5 U5.3 | 83.5,12.5 C22.+
  Bottom 0.4: L5.2 57.72,54.53 58.12,54 65,54 65.25,54.25 67.69,54.25
  Bottom 0.5: U5.1 83.25,17.5 82.12,17.5 | 82.12,17.5 82,17.38 82,15.75 82.12,15.62 | 82.12,15.62 82.2,15.55 U5.3 | 67.69,54.25 U4.4 | U4.3 67.69,54.25 | 67.69,54.25 v69.12,53.75 | C30.1 61.8,32.95 U15.5 61.8,35.45 | 82.12,17.5 82.12,15.62 | 82.12,15.62 83.38,15.62 83.62,15.38 83.62,12.38 83.5,12.25 83.5,11.5 v85,10
  Bottom 0.75: 83.5,12.5 83.5,15.5 | R25.2 36.25,3.5 | 36.25,3.5 39,3.5 | K1.1 41.5,3.5 39,3.5 | 39,3.5 D4.C | R26.1 37.1,10.35 36.25,9.5 36.25,3.5 | Y1.4 52.1,26.85 51,25 47.25,25 46,26.75 C27.1 v46,22.5 | 31.86,62.25 33.38,62.25 34.5,61.5 34.5,57 33.12,55.62 33.12,52.25 34.25,51.38 v34.25,49.88 | 61.8,32.95 62.7,32.95 63.12,33.38 v63.75,33.38
  Bottom 1: K2.1 41.81,38.31 41.5,38 D5.C | U10.1 31.86,62.25
  pour Top (rank 2, no thermals): 38.5,0.27 98.68,0.27 98.68,84.73 59.55,84.73 59.55,55.75 49.12,55.75 48.38,55.12 48.38,51 32.5,51 32.5,29.5 38.5,29.5
+12.5V
  Bottom 0.3: X12.23 86.88,47.75 87.25,48.12 87.25,53.25 88,54 89.12,54 89.6,54.48 C19.1
  Bottom 0.75: U6.1 82.66,57.25 83.12,57 C19.1
+28V  (via drill 0.6)
  Top 0.25: U11.9 56.5,6.5
  Top 0.406: 68.91,75.39 U1.2
  Top 0.5: 56.5,6.5 54.14,8.86 Q4.2
  Top 0.6: 65.75,75.39 68.91,75.39
  Top 1: v37.25,67 37.25,68.25 38.25,69.25 40.5,69.25 41.75,68.25 41.88,66.83 U2.2 | R18.2 83.5,28.5 84.12,29.12 85.5,29.12 86.12,28.5 v86.12,22.12
  Top 1.016: 65,80.75 65,76.25 65.75,75.39
  Top 1.422: 41.88,66.83 41.88,75.5 43,76.75 49.75,76.75 52,74.5 60.25,74.5 62,76.25 62,79.5 63.25,80.75 65,80.75 C11.+
  Layer2 0.75: v84.62,65.75 83.12,63.5 71.25,63.5 70.12,62.38 70.12,57.12 69,55.88 48.12,55.75 48.12,59.88 47.5,60.25 42.38,60.25 41.75,60.88 41.75,66.33 U2.2
  Layer2 1: v86.12,22.12 86.12,28.25 85.12,29.25 61.25,29.25 60.12,28.12 54.62,28.12 54.62,29.89 R17.2
  Bottom 0.75: C18.1 82.62,66.53 U6.6 82.67,64.67 v84.62,65.75
  Bottom 1: U2.2 41.75,66.33 41.75,62.75 42,62.5 D2.A D3.C 41.5,62.5 41.75,62.25 41.75,60.5 41.25,60 R7.2 | C10.+ v37.25,67
  pour Layer2 (no thermals): 40.5,59.02 46.75,59 46.75,53.5 53.25,53.5 53.25,37.25 51.88,36 50.75,35 50.75,31.12 51.25,30.62 53.25,30.62 53.12,16 55.25,16 55.25,23.5 56.5,23.5 56.5,31.5 55.5,31.5 55.5,32.88 53.38,32.88 53.38,34.75 55.5,37.38 55.5,56.25 49.5,56.25 49.5,61.75 43.25,61.75 43.25,69.75 40.5,69.75
-5V
  Top 0.5: 74,40.88 73.62,40.5 69.12,40.5 67.72,41.91 U9.4 59.51,42 59,42 59,43.25 57,45.25 57,47.75 | 74,40.88 U8.11 | R40.2 80.25,28.12 82.12,30 82.12,33.38 79.38,34.62 79.38,39.62 78.38,40.62 74.25,40.62 74,40.88
  Top 0.75: C25.+ 52.05,47.75 57,47.75 U3.2
FAN
  Top 0.75: R12.1 R10.1 51.65,18.59 Q4.3
  Bottom 1.5: Q4.3 51.6,15.9 52.75,14.75 52.75,9.1 C13.1 52.8,8.95 C14.+
  pour Layer2 (no thermals): 44.5,7.5 83.5,7.5 83.5,16.38 97.5,16.38 97.5,18.88 81,18.88 81,9.88 46.38,9.88 46.38,16.5 52.5,16.5 52.5,20.5 44.5,20.5
GND  (via drill 0.6, 1, 1 pad 2.18, 4.5 pad 9)
  Top 0.25: 72.75,7.5 U11.4 U11.3
  Top 0.4: R11.2 74.65,8 83.25,8 84,7.25 X11.6
  Top 0.406: U1.1 U1.8 U1.7 | D1.A 75.25,69.38
  Top 0.5: 72.75,7.5 73.1,7.85 R11.2 | 52.12,54.25 52,54.25 | 57,54.25 52.12,54.25 | 52.12,54.25 52,54.12 | 88.64,56.99 88.75,56.88 | U13.2 91.12,36 93.38,33.75 95.58,33.75 X9.2 | U14.2 92.75,43 94,41.75 95.58,41.75 X8.2 | C15.2 68.9,29.1 v72,26 | R23.2 U9.1 | U9.1 | U9.1 59.6,35.03 58.62,34.12 58.52,34.02 v58.52,33.12
  Top 0.75: R13.2 44.25,25 43.25,26 41.88,26 K2.O2 | C25.- 52.05,54.25 57,54.25 U3.5 | U12.3 88.64,54.88 | 88.64,54.88 U12.6 88.64,56.99 | 88.75,56.88 95.5,56.88 X7.2 | R38.2 88.61,54.9 88.64,54.88 | R21.2 79.1,29.35 79.12,29.38 79.12,31.12 v79.25,31.25 | Q6.E 70.5,22.87 | 70.5,22.87 70,23.38 68.03,23.38 Z1.A | 70.5,22.87 70.5,24.5 v72,26 | C8.2 75,12 75.62,11.38 75.62,9.62 74.5,8.88 R11.2
  Top 1: R9.1 32.88,67 31.88,68 31.88,75.62 30,77.5 30,79.98 X4.2 | v52,51 C25.-
  Top 1.3: C20.- 83.5,14.12 84.88,12.75 89.25,12.75 v92,10
  Bottom 0.2: U16.6 76.88,11.53
  Bottom 0.25: X12.16 84.25,44.25 84.5,44 84.5,42.5 84.25,42.25 X12.12 X12.11 | X12.7 82.12,39.75 | 82,37.75 X12.3 | U17.2 73.72,44.58 76.5,46.75 81.75,46.75 81.88,46.88 | 76.88,11.53 C28.2
  Bottom 0.3: 83.25,53.25 X12.24 82.25,48.25 81.88,47.88 81.88,46.88 81.88,46.5 82.12,46.25 X12.20 X12.19 X12.18 X12.17 X12.16 | X12.11 X12.10 84.12,41.25 84.38,41 84.38,40.38 84.25,40.25 X12.8 X12.7 | X12.1 X12.2 X12.3 | 82.12,39.75 81.88,39.5 81.88,38 82,37.75 | 74.78,32.73 R43.1
  Bottom 0.5: C22.- 80.38,15.22 U5.4 | CF2.3 CF3.3 | C23.- 85.12,19 85.12,16.88 84.75,16.5 U5.2 85.25,16.5 | 91.75,10 v92,10 | 70.25,56 69.75,56.75 67.12,56.75 66.75,56.12 U4.2 U4.1 65.75,55.5 C29.1 | C17.1 70,50.75 70.25,51 70.25,50.88 70.12,50.75 | U15.6 61,35.38 60,34.38 60,30.38 60.25,30.12 61.73,30.12 C30.2 | 80.47,12.03 80.44,10.56 | U7.1 70.59,14.4 68.5,16.62 68.5,23.75 67.5,25 62.25,25 61.75,25.5 v61.75,27.25 | U15.28 61,51.75 61.5,52.5 v63.38,52.5 | R47.1 74.78,32.73
  Bottom 0.6: 70.25,56 70.25,51
  Bottom 0.75: 42,26.26 K2.O2 | 49.88,30.25 Y1.2 | 85.25,16.5 91.75,10 | 80.38,10.62 80.44,10.56 | X8.2 95.58,41.75 94,41.75 92.75,43 R34.2 91.85,45.6 92.5,46.25 92.5,47.88 C16.- | C19.2 95.37,57 X7.2 | U6.5 U6.4 | U6.5 U6.2 80.75,58.45 80.75,54.5 81.5,53.75 82.75,53.75 83.25,53.25 | C26.2 62,9.6 59.2,6.8 | Q1.2 48.2,6.05 49,5.25 49,2.75 49.75,2 58.5,2 59.25,2.75 59.25,4.95 C14.- | R43.1 78.97,32.65 79.25,32.38 v79.25,31.25 | 72,24 CF1.3 | U6.5 80.72,66.03 80.25,66.5 75.38,66.5 v75.25,66.38
  Bottom 0.9: C22.- 80.38,10.62
  Bottom 1: Q2.2 38.05,45.05 39.12,45.75 39.12,51.1 38.34,51.85 C4.- | 42,26.26 42,29.5 42.9,30.4 C27.2 47.6,30.4 47.75,30.25 49.88,30.25 | CF1.3 CF2.3 | v72,26 72,24 | 80.44,10.56 82.88,8.12 87,8.12 89.12,10 v92,10 | C30.2 v61.75,27.25 | C28.2 80.47,12.03 | Q7.2 89.78,72.78 v92,75
  Bottom 1.5: C13.2 57.5,9 59.2,6.8 C14.- v62.25,5 | v92,75 85.38,72.62 85.38,69.28 C18.2 | C29.1 63.9,58.35 v63.88,58.38 | C6.1 38.19,57 C4.-
  Bottom 2: C9.- 35.7,82.2 33.5,80 X4.2 30,79.98 30,77.5 31.88,75.62 C10.-
  other vias: 7,75 7,10 77.75,81.25 77.75,77.12 77.75,72.88 82.62,77.12 82.62,72.88
  pour Layer3 (isolate 0.3, no thermals): 0.32,0.27 98.68,0.27 98.68,84.73 0.32,84.73 0.25,38.25 16.25,38.25 16.25,64.75 13.25,64.75 13.25,75.75 29.5,75.75 29.5,38.5 32.5,38.5 32.5,29.5 38.5,29.5 38.5,12.5 30.5,12.5 30.5,7.25 14.75,7.25 13.5,8.5 13.5,14 11,16.5 0.32,16.5
  pour Top (isolate 0.3, no thermals): 72.5,64.39 79.5,64.39 79.5,69.75 80,70.38 92,70.38 92,79.62 80,79.62 79.5,80.12 79.5,83.25 72.5,83.25
HOUT
  Bottom 1.3: R6.1 23.23,51.15 22.88,51.5 Q3.T2
  pour Layer2 (isolate 0.5, no thermals): 14.5,65.77 17.5,65.77 17.5,50.25 25.25,50.25 25.25,32.25 31.25,32.25 31.25,37.25 28.25,37.25 28.25,65.75 20.25,65.75 20.25,74.5 18,74.5 18,84 14.5,84
L
  pour Layer2 (isolate 0.5, no thermals): 14.75,9.27 15.25,8 23.5,8.02 23.5,20.25 20.68,20.25 18.75,22 18.75,37 10,37 9.82,36.98 1.5,36.98 1.5,18 11.62,18 14.75,15
N$1
  Top 0.75: Q4.1 59.16,16.06 Q5.C@1 Q5.C 66,16 | 71.94,16 Q6.C@1 Q6.C
  Top 1.5: R16.1 58.5,24.96 58.5,22.25 56.68,20.43 Q4.1 | 66,16 71.94,16
N$2
  Layer2 1.5: 10.84,33.98 R45.1
  Layer2 2: X2.2 10.84,33.98
N$3  (via drill 0.6)
  Top 0.5: 72.75,42.74 U8.12 72.75,44.22 v71.83,44.9 | R14.1 v68.12,37.12
  Layer2 0.5: v68.12,37.12 68.12,45.75 68.75,46.38 71.05,46.38 v71.83,44.9
N$4
  Layer2 1.5: C1.1 R2.2
N$5
  Layer2 1.5: C2.1 R3.2
N$6
  Bottom 1.3: U10.6 24.96,62.04 25.5,61.5 R6.2
N$7
  Bottom 0.25: U17.4 74.72,44.42 76.75,46.25 81.25,46.25 82.05,45.7 82.05,44.32 82.38,43.75 X12.15
  Bottom 0.3: X12.15 X12.14
N$8
  Bottom 1.3: R5.1 15,54 20.5,54
  Bottom 1.5: U10.4 22.14,56.75 20.62,56.75 20.54,56.66 Q3.G 20.5,54
N$9
  Bottom 0.2: 75,10.12 75.25,10 U16.3
  Bottom 0.25: U7.7 71.86,7.13 72,6.88 73.5,6.88 73.78,7.25 73.78,9.75 74,10.12 75,10.12
N$10
  Bottom 0.2: 74.41,8.65 75.38,9.6 U16.2
  Bottom 0.25: U7.5 74.41,8.65
N$11
  Bottom 0.25: U17.5 74.72,42 76.25,43.38 76.25,44.88 77,45.75 81.12,45.75 81.5,45.38 81.5,44.12 81.88,43.38 81.88,43.12 82.25,42.75 X12.13
N$12
  Bottom 0.2: 75.25,10.75 75.75,10.4 U16.4
  Bottom 0.25: U7.6 73.14,10.26 73.5,10.75 75.25,10.75
N$13  (via drill 0.6)
  Layer3 0.3: v71.5,32.62 71.5,29.25 73.38,27.38 73.38,18.88 74.12,18.12 81.12,18.12 81.75,17.62 81.75,11.5 81.12,10.75 v79.12,10.75
  Bottom 0.2: U16.8 78.78,10.4
  Bottom 0.25: 78.78,10.4 v79.12,10.75
  Bottom 0.3: U15.44 69.75,39 70.25,38.62 70.25,33.12 70.75,32.62 v71.5,32.62
N$14  (via drill 0.6)
  Top 0.25: U11.10 68.25,6
  Top 0.5: 68.25,6 68.5,6.25 68.5,9.25 68,9.5 67.75,9.5 67.6,9.65 C8.1
  Top 0.75: C8.1 67.6,13.22 v68.62,14.25 | v66.5,21.62 67.12,21.62 67.5,21.25 Q5.B
  Bottom 0.75: v68.62,14.25 68.62,14.5 65.88,17.25 65.88,21 v66.5,21.62
N$17
  Top 0.25: U11.2 72.75,6.5
  Top 0.5: 72.75,6.5 73.1,6.15 R11.1
N$18
  Bottom 0.254: 39,8.75 D4.A
  Bottom 0.75: D4.A 39.62,8.62 K1.2 41.75,10.75 41.75,8.25 42.4,7.6 Q1.3
N$19
  Top 1: R8.2 38.15,63.52 39.25,64.5 39.25,66.38 U2.1
  Bottom 1: R7.1 38.62,60.48 38.62,61.12 37.88,61.88 D3.A 37.88,63.38 39.25,64.75 39.25,66.38
  Bottom 1.5: C9.+ 42,72 39.25,68.5 39.25,66.38 U2.1
N$20
  Top 1: R8.1 34.88,66.97 R9.2
N$21
  Bottom 1: Q2.3 34.4,41.52 K2.2 34.19,38.56 34.75,38 D5.A
N$22
  Top 0.25: U11.1 71.25,5.86
  Top 0.4: 71.25,5.86 71.25,3.75 70.88,3.12 46.12,3.12 45.25,4.38 45.25,19 46.75,20.25 48.25,20.25 49.25,21.25 49.25,22.5 R10.2
N$23
  Top 0.406: 71.62,63.83 L6.1
  Top 0.6: U1.3 71.26,74.11
  Top 0.813: 71.26,74.11 71.62,73.5
  Top 1.016: 71.62,73.5 D1.K
  Top 1.27: D1.K 71.62,63.83
N$24
  Top 0.75: Q5.E 64.5,23.1 Z1.C 64,23.6 64,28 62,30 R17.1
N$25
  Bottom 0.75: L1.8 93.89,30.35 X10.1
N$26
  Top 0.75: R15.1 74.72,19.35 74.38,19 73.52,19 Q6.B
N$27
  Bottom 0.75: L1.1 94.05,27.81 X10.2
N$29
  Bottom 0.2: U16.10 78.15,9.6 78.38,9.38
  Bottom 0.25: 78.38,9.38 R36.2
N$30
  Bottom 0.2: U16.9 78.5,10 79.75,8.88
  Bottom 0.25: 79.75,8.88 79.75,8.25 R37.2
N$31  (via drill 0.6)
  Layer2 0.5: v75.75,57.25 75.75,51.75 73,49 73,48.25 72.5,47.75 72.5,47.25 74.5,45.25 74.5,41.75 75,41.12 v79.75,41.12
  Bottom 0.3: 66.94,41.38 U15.41
  Bottom 0.5: U6.3 78.81,59.57 78.12,60.25 76.5,60.25 75.75,59.5 v75.75,57.25 | v79.75,41.12 79.12,41.12 78.38,40.5 78.38,36.75 77.62,36 73.25,36 72.38,35.12 72.38,34.62 72.25,33.75 71.38,33.75 71.25,34.5 71.25,40.38 70.12,41.38 66.94,41.38
N$32
  Bottom 0.3: X12.21 87.5,46.75 88.12,46.12 88.12,44 89.12,43 R34.1
N$33
  Top 0.5: R12.2 50.35,30.6 51.38,31.62 63.5,31.62 64.62,30.5 71.88,30.5 73.25,31.38 73.25,34.75 72.75,35.25 U8.3
  Top 0.75: R13.1 R12.2
N$34
  Top 0.75: U9.5 U9.6
N$35
  Top 0.5: U8.1 U8.2
  Top 0.75: U8.1 70.19,32.06 70.12,32 68.1,32 C15.1 68.12,32.02 R14.2
N$36  (via drill 0.6)
  Top 0.5: U8.13 U8.14 70.19,44.81 v70.12,44.88
  Bottom 0.5: v70.12,44.88 69.12,44.88 68.88,44.62 66.69,44.62 U15.37
N$37
  Bottom 1: U10.2 31.62,58 R19.1
N$38
  Top 0.75: 83.5,22.1 C21.1
  Top 1: X10.5 87.56,20.19 86,18.62 C20.+ 83.5,21.9 C21.1 | R18.1 83.5,22.1
N$39  (via drill 0.6)
  Layer2 0.5: v46.1,43.73 44.98,44.17 32.45,44.17 31.62,45.17 v31.62,48.7
  Layer3 0.5: v65,44.48 59.55,44.48 48,44.5 47.23,43.73 v46.1,43.73
  Bottom 0.5: U15.35 65.45,46.2 65.38,46.12 65.38,45.08 v65,44.48 | v31.62,48.7 R19.2
N$40
  Top 0.5: 75.78,24.23 74.88,25.12 74.88,34.75 75.25,35.12 75.25,37.38 U8.5
  Top 0.55: R40.1 75.78,24.23
  Top 0.75: R39.2 80,20.12 80.6,20.73 C21.2 80.25,22.35 R40.1
N$41
  Top 0.5: R20.1 77.85,37.36 U8.7 77.81,39.19 77.62,39.38 68.25,39.38 67,40.62 U9.3
N$42
  Top 0.5: R24.2 R22.1 | U9.7 50.01,39.37 50,39.38 49,39.38 47.75,40.25 47.75,55.62 48.75,56.38 58.25,56.38 59,55.75 64,55.75 65.75,54 65.75,50.75 66.88,49.62 74.75,49.62 75.38,48.62 75.38,42.7 U8.10
  Top 0.75: R24.2 50.03,39.37 U9.7
N$43
  Top 0.5: U8.6 R20.2 76.5,32.95 R21.1
N$44
  Top 0.5: U9.2 57.76,39.37 57.12,40 57.12,43.12 56.62,43.62 50.25,43.62 49.88,43.38 R22.2
  Top 0.75: R23.1 64.97,39.37 U9.2
N$45  (via drill 0.6)
  Top 0.5: U8.8 77.18,42.6 | 77.18,42.6 U8.9 | v77.18,51.75 77.18,42.6
  Layer3 0.5: v49.75,51.25 49.75,53.75 50.5,54.5 67.12,54.5 67.75,55.12 70.75,55.12 71.88,53.5 76,53.5 77.18,52.38 v77.18,51.75
  Bottom 0.5: U15.22 52.88,47 51.12,49 50.25,49 49.75,49.5 v49.75,51.25
N$46  (via drill 0.6)
  Top 0.25: U11.5 69.88,8
  Top 0.5: 69.88,8 69.62,7.75 v69.62,4.5
  Layer3 0.5: v69.62,4.5 69.62,13 70.38,13.75 70.38,14.88 68.75,16.5 68.75,24.12 67.88,25 61.38,25 59.5,26.88 58.5,26.88 57.38,28 52.62,28 52.12,28.5 52.12,37.25 v52.38,37.75
  Bottom 0.5: U15.15 52.9,41.4 52.38,41 v52.38,37.75
N$47  (via drill 0.6)
  Top 0.25: U11.6 65.88,8 65.38,8.5
  Top 0.5: 65.38,8.5 v65.38,12.75
  Layer3 0.5: v49.75,36.38 49.75,26.5 51,26.5 53.75,23.62 64.25,23.62 65,22.62 65,20.75 65.38,20.25 v65.38,12.75
  Bottom 0.5: U15.16 50.2,42.2 49.75,41.5 v49.75,36.38
N$48  (via drill 0.6)
  Top 0.25: U11.7 64.5,7.5 64,8
  Top 0.5: 64,8 64,10.62 v64,11.12
  Layer3 0.5: v46.38,33.88 46.38,24.88 47.5,23.75 47.5,20.75 63.5,20.75 64,20.25 v64,11.12
  Bottom 0.5: U15.18 47.67,43.8 47,42.88 47,39.88 46.38,39.12 v46.38,33.88
N$49  (via drill 0.6)
  Top 0.25: U11.8 62.88,7 62.5,7.25
  Top 0.5: 62.5,7.25 62.5,13.88 v62.5,14.25
  Layer2 0.5: v62.5,22.25 v62.5,14.25
  Layer3 0.5: v48,37.88 48,25.75 49.38,24.25 49.38,22.25 v62.5,22.25
  Bottom 0.5: U15.17 48.38,43 48,42.38 v48,37.88
N$50
  Bottom 0.5: Q2.1 36.6,47.15 36.62,47.88 32.88,47.88 31.62,47 31.62,39.62 33.12,38 33.12,36.38 34.5,34.25 42.75,34.25 44.5,36 44.5,44.38 45.38,45.38 55.23,45.38 U15.20
N$51
  Bottom 0.75: R25.1 28.75,3.5 28.5,3.25 26.63,3.25 K1.O2
N$52  (via drill 0.6)
  Layer2 0.5: v51.25,41.12 51.25,46.25 49.5,46.25 v49.5,47.25
  Bottom 0.5: 48.5,32.5 50.12,34.88 51.25,36.5 v51.25,41.12 | v49.5,47.25 49.5,46.75 50,46.2 U15.21
  Bottom 0.75: Q1.1 44.6,17.4 43.5,18.5 39.75,18.5 39,19.25 39,29.5 42,32.5 48.5,32.5
N$53  (via drill 0.6)
  Top 0.5: v60.75,47 60.75,46.75 62.12,45.38 63.38,45.38 v66.25,48.25 | v77.75,22.25 77.75,20.62 76.1,20.62 R15.2
  Layer3 0.5: v66.25,48.25 67.5,48.25 68.38,49.12 88.62,49.12 89.62,48.12 89.62,37.88 89,37.25 77.75,37.25 77.25,36.5 77.25,22.88 v77.75,22.25
  Bottom 0.5: U15.23 57,47.62 57.38,47 v60.75,47
N$54
  Bottom 0.75: R26.2 39,11.75 40,12.75 40,14.1 K2.S2
N$55  (via drill 0.6)
  Layer3 0.5: v60.85,43.3 57.2,43.3 56.52,42.62 v56.52,33.33
  Bottom 0.5: U15.33 65,46.95 v60.85,43.3
  Bottom 0.75: K2.P2 47.52,20.99 49.02,22.5 55.48,22.5 56.52,23.55 v56.52,33.33
N$56  (via drill 0.6)
  Layer3 0.75: v33.75,7.12 43.25,7.12 45.12,9 45.12,21.12 44.12,22.38 44.12,23.88 44.75,24.38 44.75,47.5 45.88,48.75 61.92,48.75 62.6,48.07 62.6,47.05 v62.65,47.08
  Bottom 0.5: v62.65,47.08 63.52,47.08 64.17,47.48 64.17,48.62 U15.32
  Bottom 0.75: K1.P2 21.49,4.62 22.75,5.88 33,5.88 v33.75,7.12
N$57
  Bottom 0.75: 95.58,64.75 X6.2
  Bottom 1: Q7.3 95.58,64.75
N$58
  Bottom 0.5: U15.36 68.15,45.4 68.75,46 71.88,46 72.12,46.25 74.75,46.25 75.5,47 75.5,51.25 75.12,51.62 73.5,51.62 72.88,52.25 72.88,70.75 73.5,71.38 83.5,71.38 84,70.88 84,67.62 84.62,67 85.88,67 86.5,66.38 86.5,65.25 87.95,63.8 Q7.1
N$59
  Top 0.5: U13.3 89.27,39.23 88,40.5 88,45.88 88.75,46.62 93.88,46.62 94.62,47.38 94.62,48.73 R29.1 94.65,50.27 94.88,50.5 94.88,50.97 X7.4
N$60
  Top 0.5: U12.4 90.68,52.93 91.88,54.12 95.5,54.12 X7.3 95.7,54.12 97.75,54.12 97.75,50.75 96.88,50 96,50 95.85,49.85 R28.1
N$61
  Top 0.5: U14.3 92.44,43.94 92.75,44.25 95.58,44.25 X8.1 95.85,44.52 R31.1
N$62
  Top 0.5: 95.5,59.41 X7.1 95.41,59.25 93.25,59.25 92.82,59.07 U12.5
  Top 0.75: R27.1 95.85,61.1 95.5,60.75 95.5,59.41
N$63
  Top 0.5: U14.1 90.69,42.06 91.5,41.25 91.5,40 92.5,39 R30.1
  Top 0.75: R30.1 95.85,36.52 X9.1
N$64
  Bottom 0.3: X12.22 87.5,47.25 88.25,48 C16.+
N$65
  Top 0.5: U3.3 60.44,49.81 C24.+
N$66
  Top 0.5: U13.1 R32.1
  Top 0.75: R32.1 91.25,24 92.52,22.73 X10.4
N$67
  Top 0.5: U3.4 57.95,53.33 58.25,53.62 C24.-
N$68  (via drill 0.6)
  Layer2 0.5: v91.12,38.38 91.12,46.25 90.12,47.38 v74.12,47.38
  Bottom 0.5: v74.12,47.38 R33.1 | v91.12,38.38 98.25,38.38 98.25,25.5 X10.3
N$69  (via drill 0.6)
  Layer2 0.5: v66.38,23.75 66.38,25.25 67.88,26.75 v68,26.75
  Bottom 0.25: 77.39,2.98 77.11,2.95
  Bottom 0.5: X11.1 79,2.88 77.11,2.95 78.97,5.85 R37.1 | U15.2 64.2,36.42 66.38,34.5 68,31.88 v68,26.75 | v66.38,23.75 65.25,23 64,21.25 64,12.5 65.75,11 69.38,11 69.62,10.75 69.62,6.25 72.28,2.98 77.39,2.98
N$70
  Bottom 0.3: X12.6 86.38,39.25 87.22,39.9 R35.2
N$71
  Bottom 0.5: U15.34 68.9,47 R33.2
N$72  (via drill 0.6)
  Top 0.3: 86.09,57.09 86,57
  Top 0.5: U12.8 86.09,57.09 | 86,57 82.5,57 81.5,56 v81.5,52.38
  Layer2 0.5: v58,35.62 58.75,37.12 64.12,37.12 64.75,36.5 64.75,34.38 65.5,33.62 70,33.62 70.5,34.25 91.5,34.25 92.75,35.5 92.75,50.75 92.12,51.38 82.38,51.38 82,51.75 v81.5,52.38
  Bottom 0.5: U15.11 57,36.12 v58,35.62
N$73  (via drill 0.6)
  Top 0.5: U12.7 87.38,61.12 v86.25,62.5
  Layer2 0.5: v55.38,35.62 56.25,36.62 56.25,38.25 59.5,41.88 59.5,48 60.5,49 64.88,49 66,50.88 69.88,50.88 71.38,52.25 71.38,60.62 72.62,62 85.75,62 v86.25,62.5
  Bottom 0.5: U15.12 v55.38,35.62
N$74  (via drill 0.6)
  Top 0.3: v83.75,35.75 83.75,35.62 84.25,35.12 86.67,35.12 U13.6
  Layer3 0.3: v63.5,50.25 92,50.38 92.88,49.62 92.88,36.25 92.38,35.75 v83.75,35.75
  Bottom 0.3: U15.30 62.6,49.98 62.88,50.25 v63.5,50.25
N$75  (via drill 0.6)
  Top 0.3: v81.25,41.62 81.25,38.62 81.38,38.5 81.75,38 84.5,38 85.5,37 86.67,37 U13.4
  Bottom 0.5: U15.40 70.8,42.2 72.25,40.75 72.25,37.38 72.75,36.88 76.75,36.88 77.5,37.62 77.5,41.5 78.12,42.25 80.67,42.25 v81.25,41.62
N$76  (via drill 0.6)
  Top 0.5: v85,45.38 85,44.25 85.25,43.93 86.67,43.93 U14.4
  Layer3 0.5: v58.25,45.88 59.25,45.88 59.75,45.38 63.38,45.38 64.62,46.62 73.12,46.62 73.88,46 84.5,46 v85,45.38
  Bottom 0.5: U15.19 57.1,44.6 v58.25,45.88
N$77  (via drill 0.6)
  Top 0.5: v85.75,40.5 86.5,40.5 86.75,40.75 86.75,42.04 U14.6
  Layer3 0.5: v63.25,43.12 84.62,43.12 85.12,42.62 85.12,41.12 v85.75,40.5
  Bottom 0.5: U15.9 58.6,41.23 59.12,41.75 61.88,41.75 v63.25,43.12
N$78
  Bottom 0.5: R42.2 73.52,27.63 CF1.2 CF2.2 73.5,19.48 73.5,17.88 72.83,17.2 CF3.2 72.88,15.75 72.88,15.2 73.14,14.94 U7.3
N$79
  Bottom 0.5: U15.8 59.4,34.9 59.08,34.58 52.55,34.58 52.1,33.75 Y1.3
N$81
  Bottom 0.5: R41.2 71.88,30 70.48,28.6 CF1.1 CF2.1 70.5,19.48 70.5,18 71.17,17.33 CF3.1 71.17,15.32 71.88,14.62 71.88,13.48 U7.2
N$84  (via drill 0.6)
  Layer2 0.5: v65.88,26.62 64.5,25.25 64.5,15 65.38,14.25 66.62,14.25 67.38,13.12 67.38,11.75 68.12,10.62 v72.12,10.62
  Layer3 0.5: v72.12,10.62 72.62,9.75 72.62,5.12 v73.62,4.25 v73.62,1.75
  Bottom 0.5: U15.3 63.4,36.1 64.75,34.75 65.62,32.25 v65.88,26.62 | v73.62,4.25 76.75,4.25 77.12,4.88 R36.1 | v73.62,1.75 74.62,1.5 81.62,1.5 X11.3
N$85  (via drill 0.6)
  Layer3 0.5: v66.25,36.38 66.25,35.5 66.62,35 74.12,35 74.88,34.25 74.75,20.38 75.25,19.75 82,19.75 82.88,19.12 82.88,8.25 84.12,6.75 86.12,6.75 86.75,6 v86.75,4.62
  Bottom 0.5: U15.1 65.05,37.33 v66.25,36.38 | v86.75,4.62 86.75,6 86.12,6.75 82.62,6.75 82,6.12 X11.4
N$86  (via drill 0.6)
  Layer3 0.5: v62.88,35.12 61.75,34.38 61.75,29.88 63.62,28 69.38,28 70.38,27 70.25,17.5 71.62,16 71.62,13 71,12.38 71,4.75 71.75,3.88 v71.75,1.38
  Bottom 0.5: U15.4 62.6,35.4 v62.88,35.12 | v71.75,1.38 72.62,0.62 83.62,0.62 84,1.25 X11.5
N$87
  Top 0.75: R38.1 86.03,53.6 86.12,53.5 86.12,52.96 U12.1
N$88
  Bottom 0.5: L2.4 84.19,31.86 L1.5
N$89
  Bottom 0.5: L2.1 84.19,26.14 L1.4
N$90
  Bottom 0.5: L2.3 78.92,29.75 L3.2
N$91
  Bottom 0.5: L2.2 78.92,28.25 L4.2
N$92
  Bottom 0.5: L3.1 75.1,29.75 R41.1 R43.2
N$93
  Bottom 0.5: L4.1 76.1,28 R42.1 R44.1
N$94
  Bottom 0.5: U15.27 60.2,51.8 59.88,52.25 58,52.25 56.12,54 56.12,56.38 56.5,57.12 58.62,57.12 59.25,56.38 59.25,55.28 L5.1
  Bottom 0.75: C29.2 L5.1
N$99
  pour Top (isolate 0.5, no thermals): 14.75,8.77 15.25,8 29.25,8.02 29.25,13.75 37.25,13.75 37.25,28.25 31.25,28.25 31.25,37.25 28.25,37.25 28.25,74.5 21.5,74.5 21.5,84 14.5,84 14.5,65.75 17.5,65.75 17.5,37 9.82,37 1.5,36.98 1.5,18 11.62,18 14.75,15
RESET-I2C
  Bottom 0.3: U15.7 60.12,37.41 60.12,38.88 60.5,39.25 64.62,39.25 66.12,37.88 67.12,37.88 67.88,38.25 68.62,38.25 69.12,37.75 R46.1
RESET-I2C-3.3
  Bottom 0.3: R46.2 69.12,31.38 69.62,30.88 71.75,30.88 72.5,31.62 73.12,31.62 73.5,32 73.5,34.1 R47.2 73.47,34.85 73.88,35.25 75.88,35.25 76.12,35 76.12,33.88 76.5,33.5 81.38,33.5 81.75,33.88 81.75,37.12 81.25,37.62 81.25,39.75 82.25,40.75 X12.9
SCL-I2C
  Bottom 0.25: U15.39 71.9,43 73.22,41.95 U17.8
SDA-I2C
  Bottom 0.25: 66.72,43.75 72.8,43.75 U17.1
  Bottom 0.3: U15.38 66.72,43.75
SL1
  pour Layer2 (isolate 0.5, no thermals): 24.5,8.02 29.25,8.02 29.25,17.5 30.5,18.75 37.25,18.75 37.25,28.25 31.75,28.25 31.75,24.23 30.5,22.98 24.5,22.98
SL2
  Bottom 1.3: R5.2 15,49 20.5,49
  Bottom 1.5: 20.5,49 Q3.T1
  pour Layer3 (no thermals): 17.5,13.77 29.5,13.77 29.5,13.75 37.25,13.75 37.25,18 25.25,18 25.25,50.25 17.5,50.25

### Text on the board
tPlace: Heater | PE/Ground | Transformer / Secondary | Akram S. Sadek / England, U.K. / 2018 | Buzzer | Encoder | Down | Hazardous! Live | Transformer / Primary | Up | L | T- | N | T+ | Mains | LED | L | Switch | N | Tach | Fan | ver 2.0 | 858D++
bPlace: Heater | PE/Ground | Transformer Secondary | Buzzer | Encoder | Hazardous! Live | Down | Transf. Primary | Up | T- | T+ | LED | Mains | Switch | Tach | Fan | ICSP
tNames: ICSP